# EAGLE design AZPR EvBoard (EAGLE 6.1)
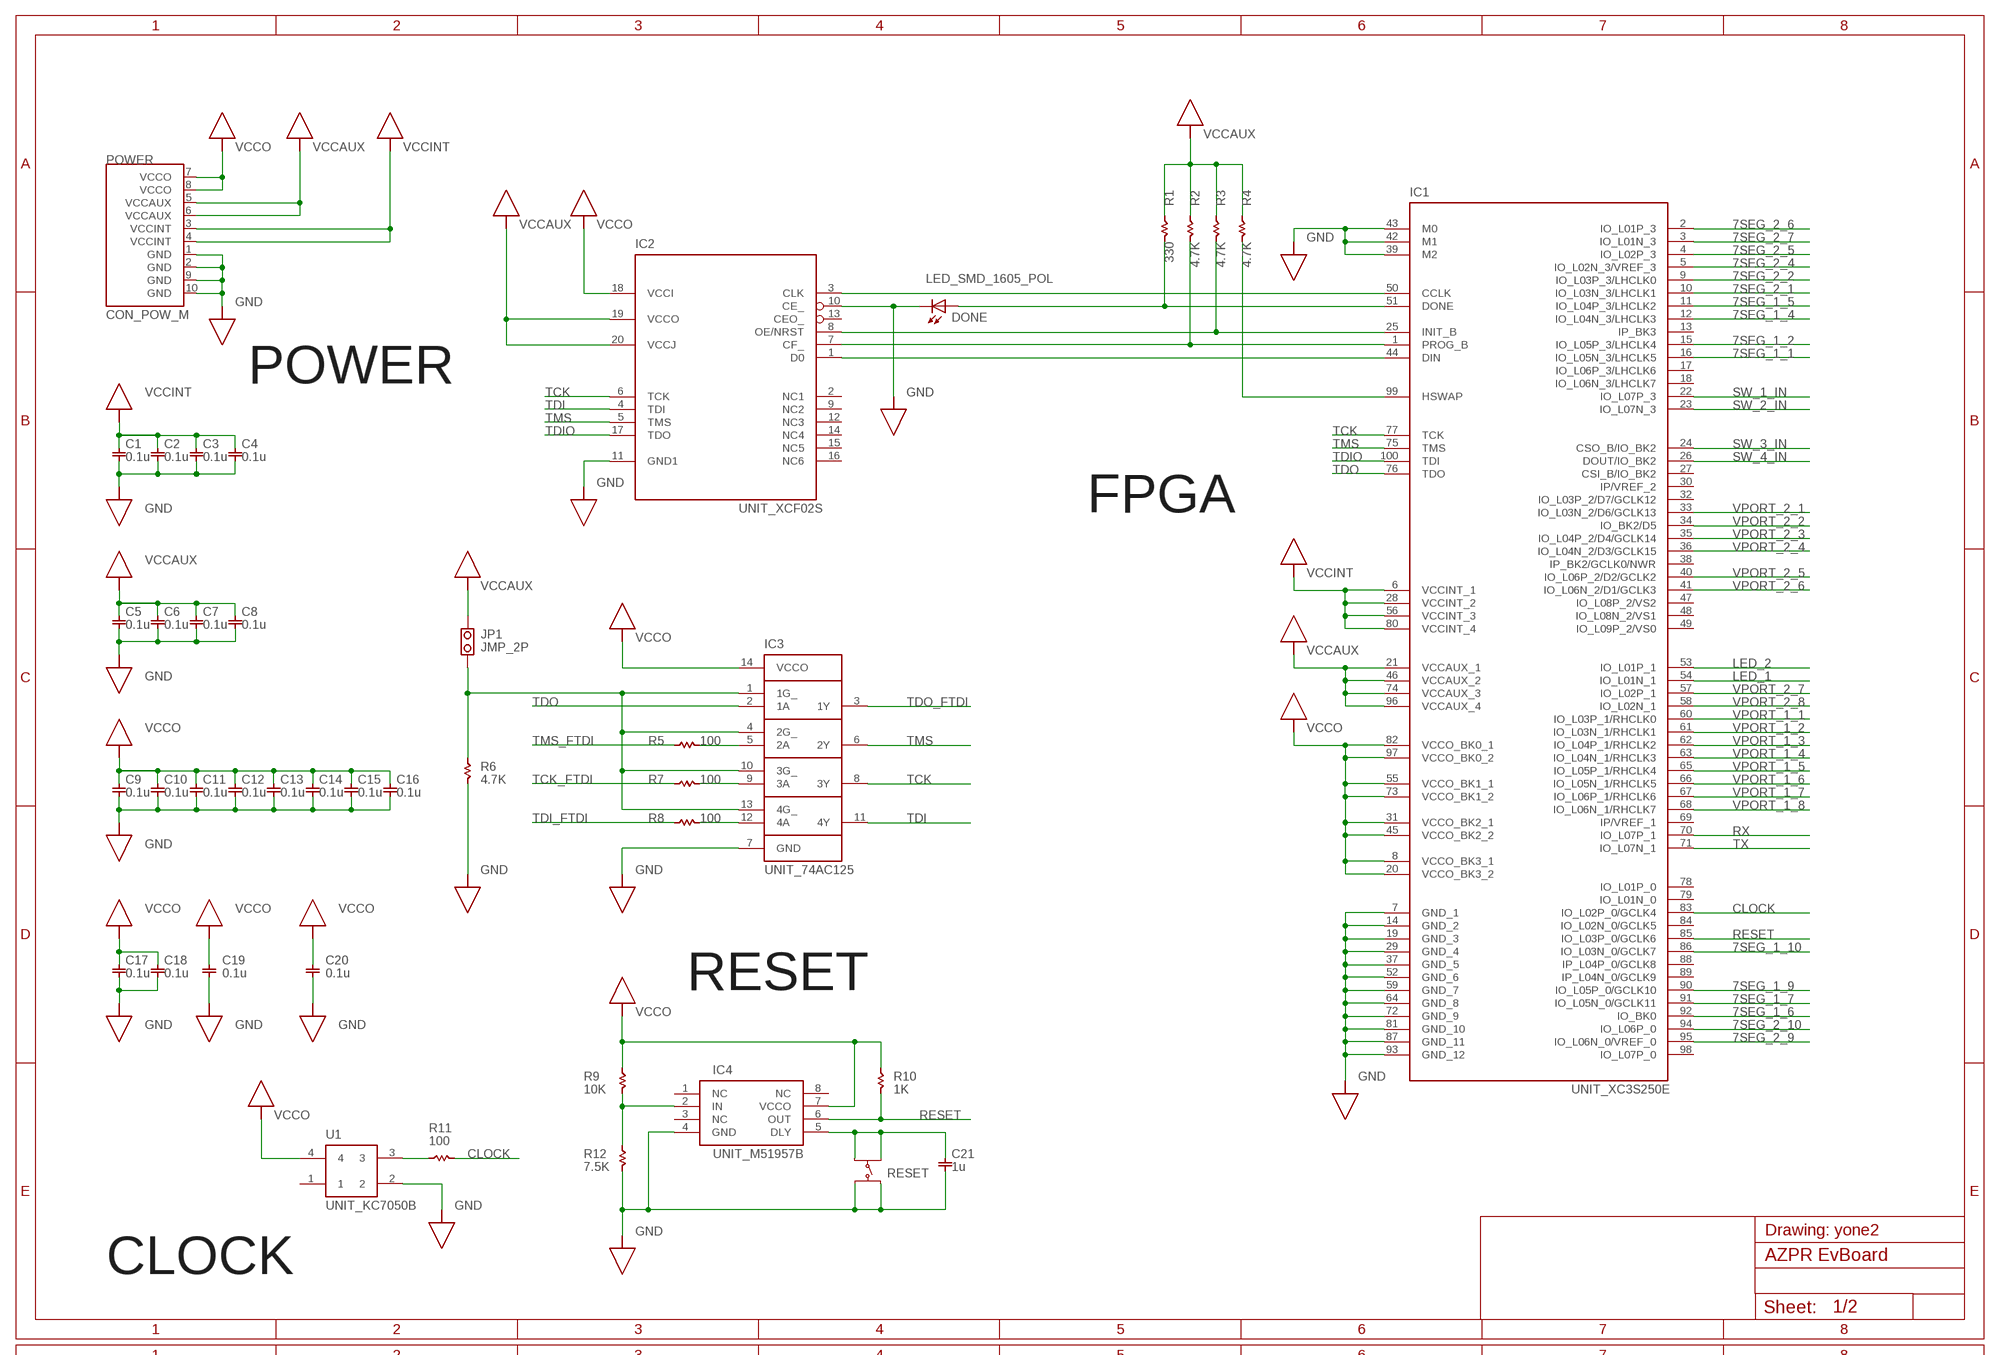
[diagram p0: schematic, sheet 1, part 1 of 2]
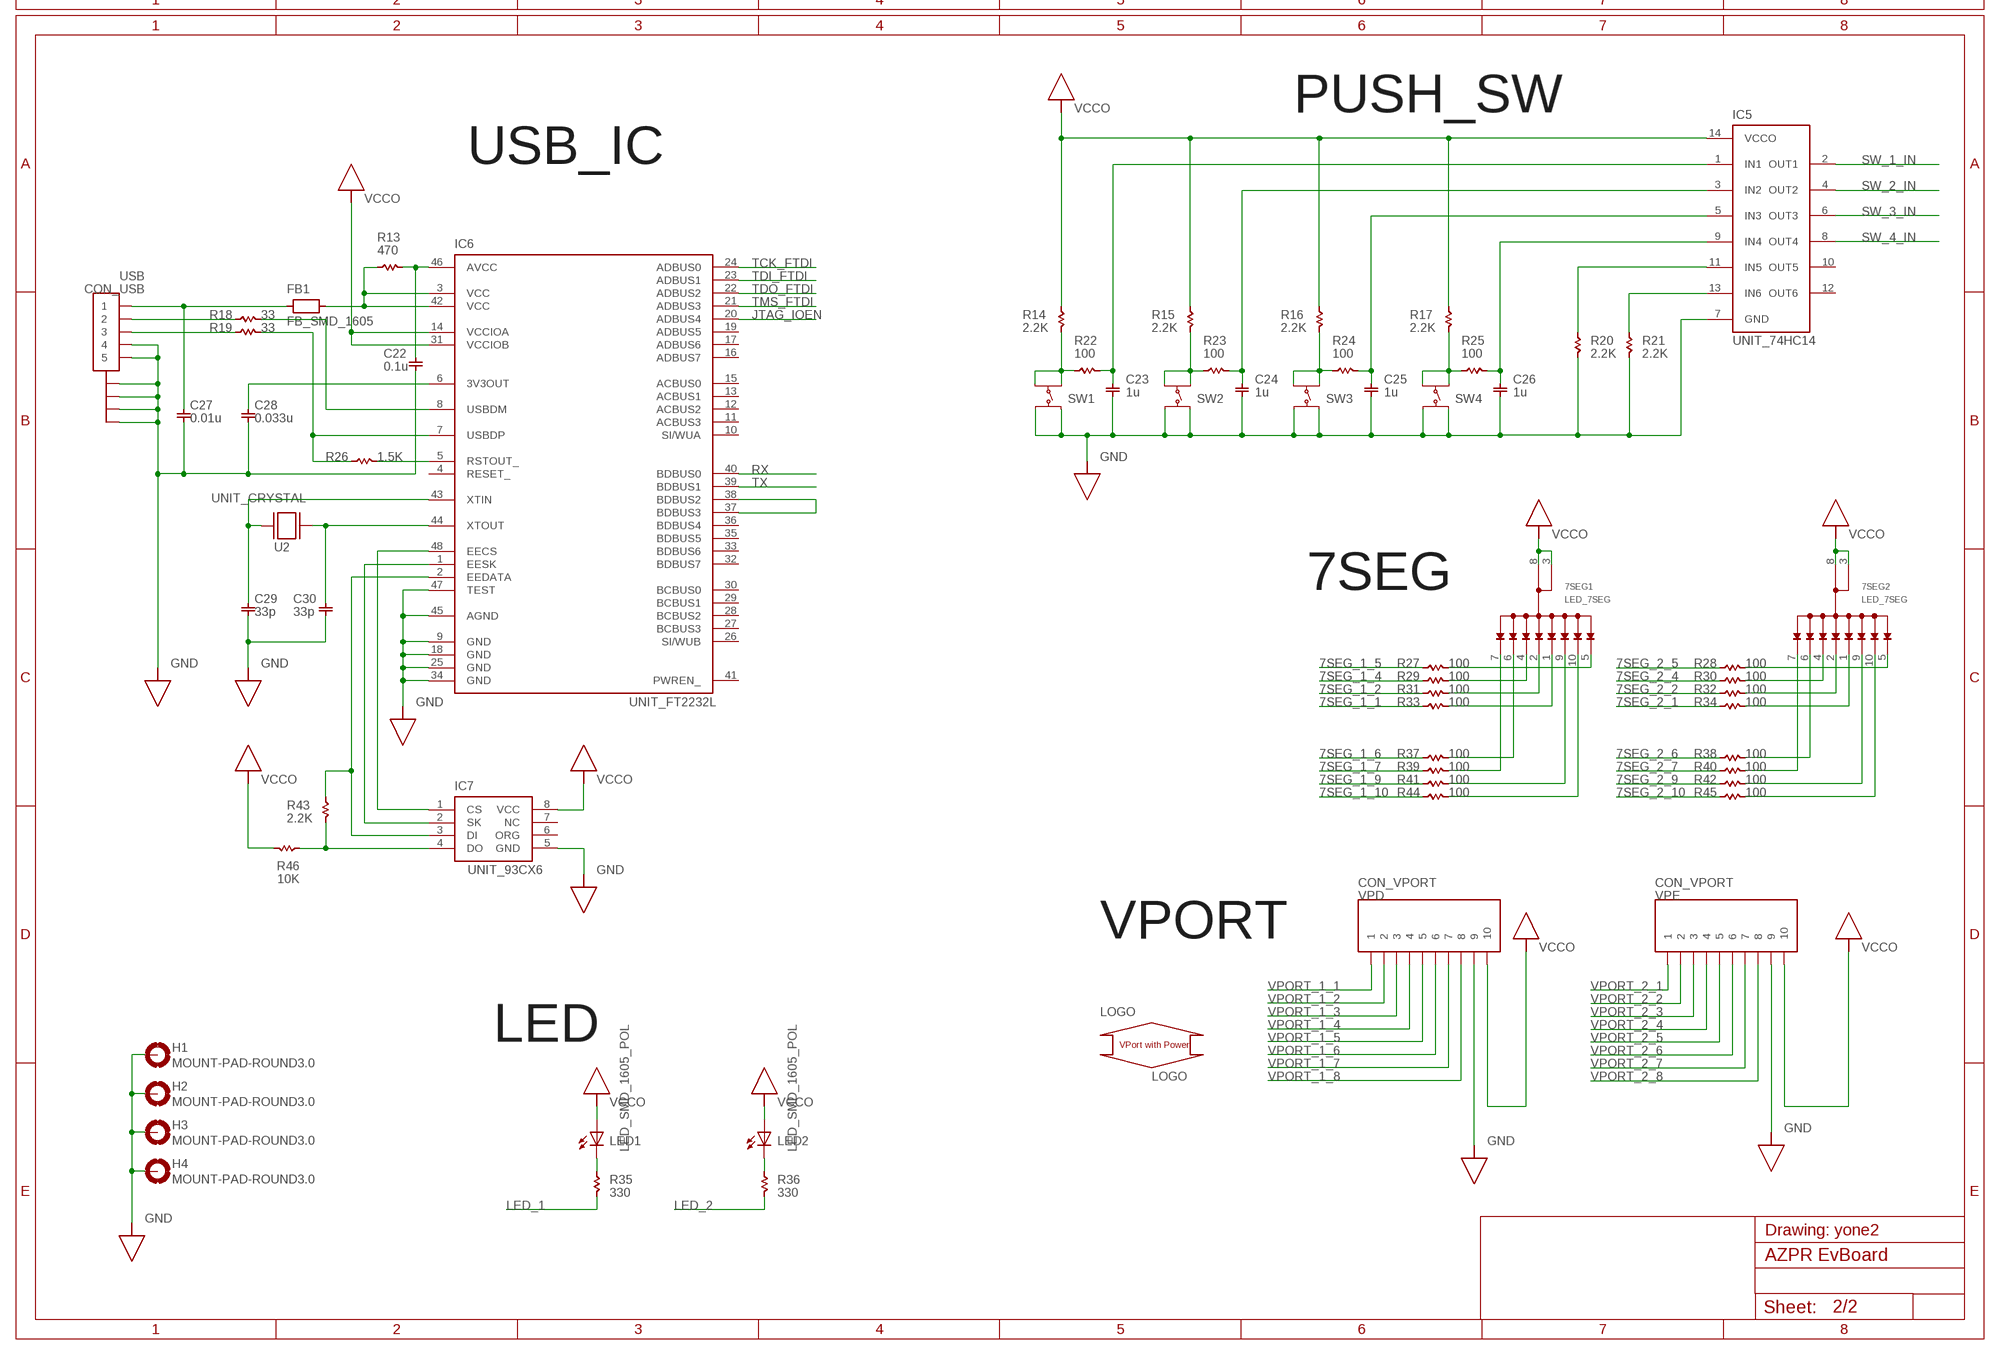
[diagram p1: schematic, sheet 1, part 2 of 2]

## Parts
7SEG1  LED_7SEG  [SMD_LED_7SEG]
7SEG2  LED_7SEG  [SMD_LED_7SEG]
C1  0.1u  CAP_SMDPAD_1605_04INCH  [SMDPAD_1605_04INCH]
C2  0.1u  CAP_SMDPAD_1605_04INCH  [SMDPAD_1605_04INCH]
C3  0.1u  CAP_SMDPAD_1605_04INCH  [SMDPAD_1605_04INCH]
C4  0.1u  CAP_SMDPAD_1605_04INCH  [SMDPAD_1605_04INCH]
C5  0.1u  CAP_SMDPAD_1605_03INCH  [SMDPAD_1605_03INCH]
C6  0.1u  CAP_SMDPAD_1605_03INCH  [SMDPAD_1605_03INCH]
C7  0.1u  CAP_SMDPAD_1605_03INCH  [SMDPAD_1605_03INCH]
C8  0.1u  CAP_SMDPAD_1605_03INCH  [SMDPAD_1605_03INCH]
C9  0.1u  CAP_SMDPAD_1605_02INCH  [SMDPAD_1605_02INCH]
C10  0.1u  CAP_SMDPAD_1605_02INCH  [SMDPAD_1605_02INCH]
C11  0.1u  CAP_SMDPAD_1605_02INCH  [SMDPAD_1605_02INCH]
C12  0.1u  CAP_SMDPAD_1605_02INCH  [SMDPAD_1605_02INCH]
C13  0.1u  CAP_SMDPAD_1605_02INCH  [SMDPAD_1605_02INCH]
C14  0.1u  CAP_SMDPAD_1605_02INCH  [SMDPAD_1605_02INCH]
C15  0.1u  CAP_SMDPAD_1605_02INCH  [SMDPAD_1605_02INCH]
C16  0.1u  CAP_SMDPAD_1605_02INCH  [SMDPAD_1605_02INCH]
C17  0.1u  CAP_SMDPAD_1605_02INCH  [SMDPAD_1605_02INCH]
C18  0.1u  CAP_SMD_1605  [SMD_1605]
C19  0.1u  CAP_SMD_1605  [SMD_1605]
C20  0.1u  CAP_SMD_1605  [SMD_1605]
C21  1u  CAP_SMD_1605  [SMD_1605]
C22  0.1u  CAP_SMD_1605  [SMD_1605]
C23  1u  CAP_SMD_1605  [SMD_1605]
C24  1u  CAP_SMD_1605  [SMD_1605]
C25  1u  CAP_SMD_1605  [SMD_1605]
C26  1u  CAP_SMD_1605  [SMD_1605]
C27  0.01u  CAP_SMD_1605  [SMD_1605]
C28  0.033u  CAP_SMD_1605  [SMD_1605]
C29  33p  CAP_SMD_1605  [SMD_1605]
C30  33p  CAP_SMD_1605  [SMD_1605]
DONE  LED_SMD_1605_POL  [SMD_1605_POL]
FB1  FB_SMD_1605  [SMD_1605]
H1  MOUNT-PAD-ROUND3.0  HOLE_32  [HOLE_32]
H2  MOUNT-PAD-ROUND3.0  HOLE_32  [HOLE_32]
H3  MOUNT-PAD-ROUND3.0  HOLE_32  [HOLE_32]
H4  MOUNT-PAD-ROUND3.0  HOLE_32  [HOLE_32]
IC1  UNIT_XC3S250E  [SMD_VQ100]
IC2  UNIT_XCF02S  [SMD_VO20C]
IC3  UNIT_74AC125  [SMD_SOP14]
IC4  UNIT_M51957B  [SMD_SOP8]
IC5  UNIT_74HC14  [SMD_SOP14]
IC6  UNIT_FT2232L  [SMD_LQFP48]
IC7  UNIT_93CX6  [SMD_SOP8]
JP1  JMP_2P  [PAD_JMP_2P]
LED1  LED_SMD_1605_POL  [SMD_1605_POL]
LED2  LED_SMD_1605_POL  [SMD_1605_POL]
LOGO  LOGO  [LOGO]
POWER  CON_POW_M  [PAD_POW_M]
R1  330  REG_SMD_1605  [SMD_1605_R]
R2  4.7K  REG_SMD_1605  [SMD_1605_R]
R3  4.7K  REG_SMD_1605  [SMD_1605_R]
R4  4.7K  REG_SMD_1605  [SMD_1605_R]
R5  100  REG_SMD_1605  [SMD_1605_R]
R6  4.7K  REG_SMD_1605  [SMD_1605_R]
R7  100  REG_SMD_1605  [SMD_1605_R]
R8  100  REG_SMD_1605  [SMD_1605_R]
R9  10K  REG_SMD_1605  [SMD_1605_R]
R10  1K  REG_SMD_1605  [SMD_1605_R]
R11  100  REG_SMD_1605  [SMD_1605_R]
R12  7.5K  REG_SMD_1605  [SMD_1605_R]
R13  470  REG_SMD_1605  [SMD_1605_R]
R14  2.2K  REG_SMD_1605  [SMD_1605_R]
R15  2.2K  REG_SMD_1605  [SMD_1605_R]
R16  2.2K  REG_SMD_1605  [SMD_1605_R]
R17  2.2K  REG_SMD_1605  [SMD_1605_R]
R18  33  REG_SMD_1605  [SMD_1605_R]
R19  33  REG_SMD_1605  [SMD_1605_R]
R20  2.2K  REG_SMD_1605  [SMD_1605_R]
R21  2.2K  REG_SMD_1605  [SMD_1605_R]
R22  100  REG_SMD_1605  [SMD_1605_R]
R23  100  REG_SMD_1605  [SMD_1605_R]
R24  100  REG_SMD_1605  [SMD_1605_R]
R25  100  REG_SMD_1605  [SMD_1605_R]
R26  1.5K  REG_SMD_1605  [SMD_1605_R]
R27  100  REG_SMD_1605  [SMD_1605_R]
R28  100  REG_SMD_1605  [SMD_1605_R]
R29  100  REG_SMD_1605  [SMD_1605_R]
R30  100  REG_SMD_1605  [SMD_1605_R]
R31  100  REG_SMD_1605  [SMD_1605_R]
R32  100  REG_SMD_1605  [SMD_1605_R]
R33  100  REG_SMD_1605  [SMD_1605_R]
R34  100  REG_SMD_1605  [SMD_1605_R]
R35  330  REG_SMD_1605  [SMD_1605_R]
R36  330  REG_SMD_1605  [SMD_1605_R]
R37  100  REG_SMD_1605  [SMD_1605_R]
R38  100  REG_SMD_1605  [SMD_1605_R]
R39  100  REG_SMD_1605  [SMD_1605_R]
R40  100  REG_SMD_1605  [SMD_1605_R]
R41  100  REG_SMD_1605  [SMD_1605_R]
R42  100  REG_SMD_1605  [SMD_1605_R]
R43  2.2K  REG_SMD_1605  [SMD_1605_R]
R44  100  REG_SMD_1605  [SMD_1605_R]
R45  100  REG_SMD_1605  [SMD_1605_R]
R46  10K  REG_SMD_1605  [SMD_1605_R]
RESET  SW_PUSH  [SMD_SW_PUSH]
SW1  SW_PUSH  [SMD_SW_PUSH]
SW2  SW_PUSH  [SMD_SW_PUSH]
SW3  SW_PUSH  [SMD_SW_PUSH]
SW4  SW_PUSH  [SMD_SW_PUSH]
U1  UNIT_KC7050B  [SMD_KC7050B]
U2  UNIT_CRYSTAL  [SMD_HC-49_S]
USB  CON_USB  [SMD_USB]
VPD  CON_VPORT  [PAD_VPORT]
VPE  CON_VPORT  [PAD_VPORT]

## Nets
7SEG_1_1: IC1.16(IO_L05N_3/LHCLK5) R33.1
7SEG_1_2: IC1.15(IO_L05P_3/LHCLK4) R31.1
7SEG_1_4: IC1.12(IO_L04N_3/LHCLK3) R29.1
7SEG_1_5: IC1.11(IO_L04P_3/LHCLK2) R27.1
7SEG_1_6: IC1.92(IO_BK0) R37.1
7SEG_1_7: IC1.91(IO_L05N_0/GCLK11) R39.1
7SEG_1_9: IC1.90(IO_L05P_0/GCLK10) R41.1
7SEG_1_10: IC1.86(IO_L03N_0/GCLK7) R44.1
7SEG_2_1: IC1.10(IO_L03N_3/LHCLK1) R34.1
7SEG_2_2: IC1.9(IO_L03P_3/LHCLK0) R32.1
7SEG_2_4: IC1.5(IO_L02N_3/VREF_3) R30.1
7SEG_2_5: IC1.4(IO_L02P_3) R28.1
7SEG_2_6: IC1.2(IO_L01P_3) R38.1
7SEG_2_7: IC1.3(IO_L01N_3) R40.1
7SEG_2_9: IC1.95(IO_L06N_0/VREF_0) R42.1
7SEG_2_10: IC1.94(IO_L06P_0) R45.1
CLOCK: IC1.83(IO_L02P_0/GCLK4) R11.2
EECS: IC6.48(EECS) IC7.1(CS)
EEDATA: IC6.2(EEDATA) IC7.3(DI) R43.1
EESK: IC6.1(EESK) IC7.2(SK)
EETMP: IC7.4(DO) R43.2 R46.1
GND: C1.P$2 C2.P$2 C3.P$2 C4.P$2 C5.P$2 C6.P$2 C7.P$2 C8.P$2 C9.P$2 C10.P$2 C11.P$2 C12.P$2 C13.P$2 C14.P$2 C15.P$2 C16.P$2 C17.P$2 C18.2 C19.2 C20.2 C21.2 C22.2 C23.2 C24.2 C25.2 C26.2 C27.2 C28.2 C29.2 C30.2 DONE.C H1.B3,2(MOUNT) H2.B3,2(MOUNT) H3.B3,2(MOUNT) H4.B3,2(MOUNT) IC1.7(GND_1) IC1.14(GND_2) IC1.19(GND_3) IC1.29(GND_4) IC1.37(GND_5) IC1.39(M2) IC1.42(M1) IC1.43(M0) IC1.52(GND_6) IC1.59(GND_7) IC1.64(GND_8) IC1.72(GND_9) IC1.81(GND_10) IC1.87(GND_11) IC1.93(GND_12) IC2.10(CE_) IC2.11(GND1) IC3.7(GND) IC4.4(GND) IC5.7(GND) IC6.9(GND) IC6.18(GND) IC6.25(GND) IC6.34(GND) IC6.45(AGND) IC6.47(TEST) IC7.5(GND) POWER.1(GND) POWER.2(GND) POWER.9(GND) POWER.10(GND) R6.2 R12.2 R20.2 R21.2 RESET.3 RESET.4 SW1.3 SW1.4 SW2.3 SW2.4 SW3.3 SW3.4 SW4.3 SW4.4 U1.2 USB.4 USB.5 USB.PAD@1(PAD1) USB.PAD@2(PAD2) USB.PAD@3(PAD3) USB.PAD@4(PAD4) VPD.9 VPE.9
JTAG_CCLK: IC1.50(CCLK) IC2.3(CLK)
JTAG_DIN: IC1.44(DIN) IC2.1(D0)
JTAG_DONE: DONE.A IC1.51(DONE) R1.2
JTAG_HSWAP: IC1.99(HSWAP) R4.2
JTAG_INIT_B: IC1.25(INIT_B) IC2.8(OE/NRST) R3.2
JTAG_IOEN: IC6.20(ADBUS4)
JTAG_PROG_B: IC1.1(PROG_B) IC2.7(CF_) R2.2
LED_1: IC1.54(IO_L01N_1) R35.2
LED_2: IC1.53(IO_L01P_1) R36.2
N$1: IC3.1(1G_) IC3.4(2G_) IC3.10(3G_) IC3.13(4G_) JP1.P$2 R6.1
N$2: LED1.C R35.1
N$3: IC3.5(2A) R5.2
N$5: IC3.9(3A) R7.2
N$6: IC3.12(4A) R8.2
N$11: LED2.C R36.1
N$18: IC6.37(BDBUS3) IC6.38(BDBUS2)
N$58: R11.1 U1.3
RESET: IC1.85(IO_L03P_0/GCLK6) IC4.6(OUT) R10.2
RESET_IN: IC4.2(IN) R9.2 R12.1
RESET_SW: C21.1 IC4.5(DLY) RESET.1 RESET.2
RX: IC1.70(IO_L07P_1) IC6.40(BDBUS0)
SW_1_IN: IC1.22(IO_L07P_3) IC5.2(OUT1)
SW_1_IN_T: C23.1 IC5.1(IN1) R22.2
SW_1_IN_T2: R14.2 R22.1 SW1.1 SW1.2
SW_2_IN: IC1.23(IO_L07N_3) IC5.4(OUT2)
SW_2_IN_T: C24.1 IC5.3(IN2) R23.2
SW_2_IN_T2: R15.2 R23.1 SW2.1 SW2.2
SW_3_IN: IC1.24(CSO_B/IO_BK2) IC5.6(OUT3)
SW_3_IN_T: C25.1 IC5.5(IN3) R24.2
SW_3_IN_T2: R16.2 R24.1 SW3.1 SW3.2
SW_4_IN: IC1.26(DOUT/IO_BK2) IC5.8(OUT4)
SW_4_IN_T: C26.1 IC5.9(IN4) R25.2
SW_4_IN_T2: R17.2 R25.1 SW4.1 SW4.2
SW_PD_1: IC5.11(IN5) R20.1
SW_PD_2: IC5.13(IN6) R21.1
T_7SEG_1_1: 7SEG1.1(E) R33.2
T_7SEG_1_2: 7SEG1.2(D) R31.2
T_7SEG_1_4: 7SEG1.4(C) R29.2
T_7SEG_1_5: 7SEG1.5(D.P) R27.2
T_7SEG_1_6: 7SEG1.6(B) R37.2
T_7SEG_1_7: 7SEG1.7(A) R39.2
T_7SEG_1_9: 7SEG1.9(F) R41.2
T_7SEG_1_10: 7SEG1.10(G) R44.2
T_7SEG_2_1: 7SEG2.1(E) R34.2
T_7SEG_2_2: 7SEG2.2(D) R32.2
T_7SEG_2_4: 7SEG2.4(C) R30.2
T_7SEG_2_5: 7SEG2.5(D.P) R28.2
T_7SEG_2_6: 7SEG2.6(B) R38.2
T_7SEG_2_7: 7SEG2.7(A) R40.2
T_7SEG_2_9: 7SEG2.9(F) R42.2
T_7SEG_2_10: 7SEG2.10(G) R45.2
TCK: IC1.77(TCK) IC2.6(TCK) IC3.8(3Y)
TCK_FTDI: IC6.24(ADBUS0) R7.1
TDI: IC2.4(TDI) IC3.11(4Y)
TDI_FTDI: IC6.23(ADBUS1) R8.1
TDIO: IC1.100(TDI) IC2.17(TDO)
TDO: IC1.76(TDO) IC3.2(1A)
TDO_FTDI: IC3.3(1Y) IC6.22(ADBUS2)
TMS: IC1.75(TMS) IC2.5(TMS) IC3.6(2Y)
TMS_FTDI: IC6.21(ADBUS3) R5.1
TX: IC1.71(IO_L07N_1) IC6.39(BDBUS1)
USB_33OUT: C28.1 IC6.6(3V3OUT)
USB_AVCC: C22.1 IC6.46(AVCC) R13.2
USB_CON1: C27.1 FB1.1 USB.1
USB_CON2: R18.1 USB.2
USB_CON3: R19.1 USB.3
USB_DM: IC6.8(USBDM) R18.2
USB_DP: IC6.7(USBDP) R19.2 R26.1
USB_POW: FB1.2 IC6.3(VCC) IC6.42(VCC) R13.1
USB_RSTOUT_: IC6.5(RSTOUT_) R26.2
VCCAUX: C5.P$1 C6.P$1 C7.P$1 C8.P$1 IC1.21(VCCAUX_1) IC1.46(VCCAUX_2) IC1.74(VCCAUX_3) IC1.96(VCCAUX_4) IC2.19(VCCO) IC2.20(VCCJ) JP1.P$1 POWER.5(VCCAUX) POWER.6(VCCAUX) R1.1 R2.1 R3.1 R4.1
VCCINT: C1.P$1 C2.P$1 C3.P$1 C4.P$1 IC1.6(VCCINT_1) IC1.28(VCCINT_2) IC1.56(VCCINT_3) IC1.80(VCCINT_4) POWER.3(VCCINT) POWER.4(VCCINT)
VCCO: 7SEG1.3(COMMON3) 7SEG1.8(COMMON8) 7SEG2.3(COMMON3) 7SEG2.8(COMMON8) C9.P$1 C10.P$1 C11.P$1 C12.P$1 C13.P$1 C14.P$1 C15.P$1 C16.P$1 C17.P$1 C18.1 C19.1 C20.1 IC1.8(VCCO_BK3_1) IC1.20(VCCO_BK3_2) IC1.31(VCCO_BK2_1) IC1.45(VCCO_BK2_2) IC1.55(VCCO_BK1_1) IC1.73(VCCO_BK1_2) IC1.82(VCCO_BK0_1) IC1.97(VCCO_BK0_2) IC2.18(VCCI) IC3.14(VCCO) IC4.7(VCCO) IC5.14(VCCO) IC6.14(VCCIOA) IC6.31(VCCIOB) IC7.8(VCC) LED1.A LED2.A POWER.7(VCCO) POWER.8(VCCO) R9.1 R10.1 R14.1 R15.1 R16.1 R17.1 R46.2 U1.4 VPD.10 VPE.10
VPORT_1_1: IC1.60(IO_L03P_1/RHCLK0) VPD.1
VPORT_1_2: IC1.61(IO_L03N_1/RHCLK1) VPD.2
VPORT_1_3: IC1.62(IO_L04P_1/RHCLK2) VPD.3
VPORT_1_4: IC1.63(IO_L04N_1/RHCLK3) VPD.4
VPORT_1_5: IC1.65(IO_L05P_1/RHCLK4) VPD.5
VPORT_1_6: IC1.66(IO_L05N_1/RHCLK5) VPD.6
VPORT_1_7: IC1.67(IO_L06P_1/RHCLK6) VPD.7
VPORT_1_8: IC1.68(IO_L06N_1/RHCLK7) VPD.8
VPORT_2_1: IC1.33(IO_L03N_2/D6/GCLK13) VPE.1
VPORT_2_2: IC1.34(IO_BK2/D5) VPE.2
VPORT_2_3: IC1.35(IO_L04P_2/D4/GCLK14) VPE.3
VPORT_2_4: IC1.36(IO_L04N_2/D3/GCLK15) VPE.4
VPORT_2_5: IC1.40(IO_L06P_2/D2/GCLK2) VPE.5
VPORT_2_6: IC1.41(IO_L06N_2/D1/GCLK3) VPE.6
VPORT_2_7: IC1.57(IO_L02P_1) VPE.7
VPORT_2_8: IC1.58(IO_L02N_1) VPE.8
XTIN: C29.1 IC6.43(XTIN) U2.P$1
XTOUT: C30.1 IC6.44(XTOUT) U2.P$2
Unconnected: IC1.13(IP_BK3) IC1.17(IO_L06P_3/LHCLK6) IC1.18(IO_L06N_3/LHCLK7) IC1.27(CSI_B/IO_BK2) IC1.30(IP/VREF_2) IC1.32(IO_L03P_2/D7/GCLK12) IC1.38(IP_BK2/GCLK0/NWR) IC1.47(IO_L08P_2/VS2) IC1.48(IO_L08N_2/VS1) IC1.49(IO_L09P_2/VS0) IC1.69(IP/VREF_1) IC1.78(IO_L01P_0) IC1.79(IO_L01N_0) IC1.84(IO_L02N_0/GCLK5) IC1.88(IP_L04P_0/GCLK8) IC1.89(IP_L04N_0/GCLK9) IC1.98(IO_L07P_0) IC2.2(NC1) IC2.9(NC2) IC2.12(NC3) IC2.13(CEO_) IC2.14(NC4) IC2.15(NC5) IC2.16(NC6) IC4.1(NC) IC4.3(NC) IC4.8(NC) IC5.10(OUT5) IC5.12(OUT6) IC6.4(RESET_) IC6.10(SI/WUA) IC6.11(ACBUS3) IC6.12(ACBUS2) IC6.13(ACBUS1) IC6.15(ACBUS0) IC6.16(ADBUS7) IC6.17(ADBUS6) IC6.19(ADBUS5) IC6.26(SI/WUB) IC6.27(BCBUS3) IC6.28(BCBUS2) IC6.29(BCBUS1) IC6.30(BCBUS0) IC6.32(BDBUS7) IC6.33(BDBUS6) IC6.35(BDBUS5) IC6.36(BDBUS4) IC6.41(PWREN_) IC7.6(ORG) IC7.7(NC) U1.1

## Notes on the sheet
- POWER
- FPGA
- RESET
- CLOCK
- PUSH_SW
- USB_IC
- 7SEG
- VPORT
- LED

## Library data of the parts
7SEG1 7SEG2 = 00_Respon:LED_7SEG: 7seg led LF-301VA - anode common - SMD
C1-C4 = 00_Respon:CAP_SMDPAD_1605_04INCH: ceramic capacitor - SMD or PAD package - 1605 or 2125 - 0.4-inch interval
C5-C8 = 00_Respon:CAP_SMDPAD_1605_03INCH: ceramic capacitor - SMD or PAD package - 1605 or 2125 - 0.3-inch interval
C9-C17 = 00_Respon:CAP_SMDPAD_1605_02INCH: ceramic capacitor - SMD or PAD package - 1605 or 2125 - 0.2-inch interval
C18-C30 = 00_Respon:CAP_SMD_1605: resistor SMD package 1605 or 2125 size
DONE LED1 LED2 = 00_Respon:LED_SMD_1605_POL: LED - SMD package - 0.1inch interval
FB1 = 00_Respon:FB_SMD_1605: ferrite beads SMD package 1605 or 2125 size
H1-H4 = 00_Respon:HOLE_32: Mounting PAD 3.2mm
IC1 = 00_Respon:UNIT_XC3S250E: XC3S250E-VQ100 Xilinx Spartan-3E FPGA device
IC2 = 00_Respon:UNIT_XCF02S: XCF02S Xilinx FPGA Configration ROM XCF02S VO20C
IC3 = 00_Respon:UNIT_74AC125
IC4 = 00_Respon:UNIT_M51957B: M51957B
IC5 = 00_Respon:UNIT_74HC14: 74VHC14
IC6 = 00_Respon:UNIT_FT2232L
IC7 = 00_Respon:UNIT_93CX6
JP1 = 00_Respon:JMP_2P
LOGO = 00_Respon:LOGO: VPort logo
POWER = 00_Respon:CON_POW_M: pin header - 2*5 - L angle
R1-R46 = 00_Respon:REG_SMD_1605: resistor SMD package 1605 or 2125
RESET SW1-SW4 = 00_Respon:SW_PUSH; PUSH-SW: PUSH-WS
U1 = 00_Respon:UNIT_KC7050B: KC7050B Clock Crystal Oscillators SMD pakage
U2 = 00_Respon:UNIT_CRYSTAL: Crystal Units SMD package
USB = 00_Respon:CON_USB: UX60A-MB-5ST USB mini-B connector HRS
VPD VPE = 00_Respon:CON_VPORT: BOX header - 2*5

## Board
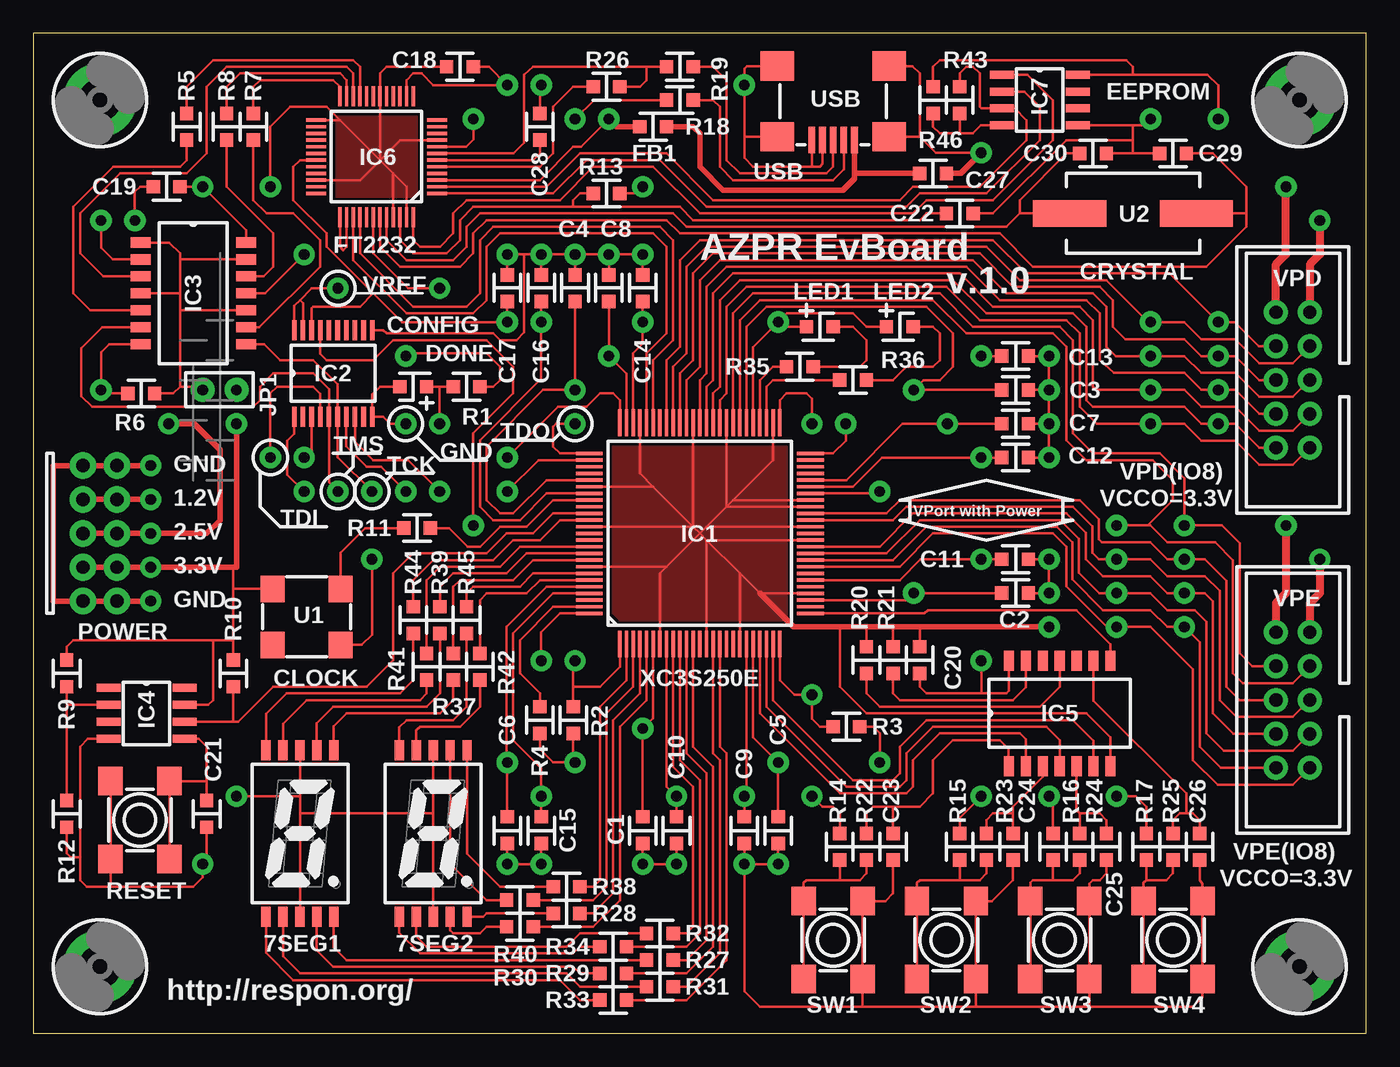
[diagram p2: board, top side]
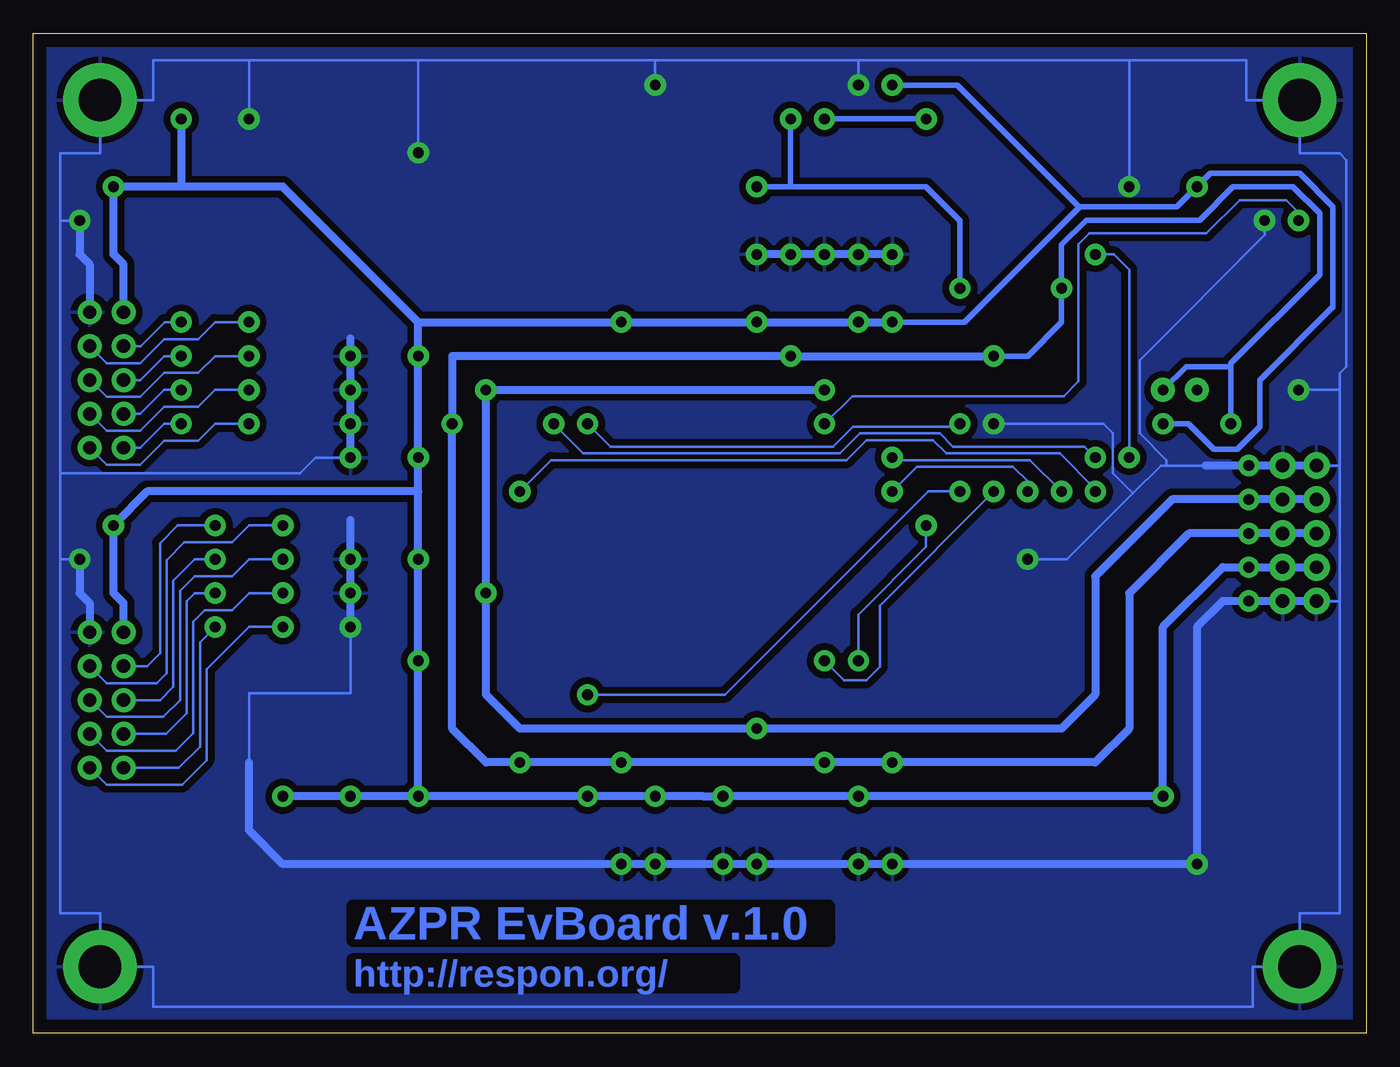
[diagram p3: board, bottom side, seen from below]

Size 100 x 75 mm. Coordinates in mm from the lower left corner, seen from the top.
Outline: 0,0 100,0 100,75 0,75 0,0
Copper layers (1*16): Top 0.035mm / dielectric 1.53mm / Bottom 0.035mm
Design rules: minimum track width 8mil, minimum drill 0.6mm, track to track 8mil, track to pad 8mil, pad to pad 8mil, via to via 8mil, smd to smd 8mil, copper to edge 40mil, drill to drill 10mil, minimum pad ring 0.15mm, minimum via ring 0.15mm, stop-mask expansion 6mil, vias tented up to drill 0.35mm, thermal gap 20mil

### Footprints (pad centres in the part's own frame; a part is rotated, then mirrored left to right if it is on the bottom)
SMD_LED_7SEG = smd 0.7 x 1.5: 1 -2.54,-6.25; 2 -1.27,-6.25; 3 0,-6.25; 4 1.27,-6.25; 5 2.54,-6.25; 6 2.54,6.25; 7 1.27,6.25; 8 0,6.25; 9 -1.27,6.25; 10 -2.54,6.25
SMDPAD_1605_04INCH = smd 1 x 1: 1 -1.54,0; 2 -3.54,0 | drill 0.8 pad 1.6: P$1 -10.16,0; P$2 0,0
SMDPAD_1605_03INCH = smd 1 x 1: 1 -1.54,0; 2 -3.54,0 | drill 0.8 pad 1.6: P$1 -7.62,0; P$2 0,0
SMDPAD_1605_02INCH = smd 1 x 1: 1 -1.54,0; 2 -3.54,0 | drill 0.8 pad 1.6: P$1 -5.08,0; P$2 0,0
SMD_1605 = smd 1 x 1: 1 1,0; 2 -1,0
SMD_1605_POL = smd 1 x 1: A -1,0; C 1,0
HOLE_32 = drill 3.2 pad 5.5: B3,2 0,0
SMD_VQ100 = smd 2 x 0.25: 1 -8.3,6; 2 -8.3,5.5; 3 -8.3,5; 4 -8.3,4.5; 5 -8.3,4; 6 -8.3,3.5; 7 -8.3,3; 8 -8.3,2.5; 9 -8.3,2; 10 -8.3,1.5; 11 -8.3,1; 12 -8.3,0.5; 13 -8.3,0; 14 -8.3,-0.5; 15 -8.3,-1; 16 -8.3,-1.5; 17 -8.3,-2; 18 -8.3,-2.5; 19 -8.3,-3; 20 -8.3,-3.5; 21 -8.3,-4; 22 -8.3,-4.5; 23 -8.3,-5; 24 -8.3,-5.5; 25 -8.3,-6; 51 8.3,-6; 52 8.3,-5.5; 53 8.3,-5; 54 8.3,-4.5; 55 8.3,-4; 56 8.3,-3.5; 57 8.3,-3; 58 8.3,-2.5; 59 8.3,-2; 60 8.3,-1.5; 61 8.3,-1; 62 8.3,-0.5; 63 8.3,0; 64 8.3,0.5; 65 8.3,1; 66 8.3,1.5; 67 8.3,2; 68 8.3,2.5; 69 8.3,3; 70 8.3,3.5; 71 8.3,4; 72 8.3,4.5; 73 8.3,5; 74 8.3,5.5; 75 8.3,6 | smd 0.25 x 2: 26 -6,-8.3; 27 -5.5,-8.3; 28 -5,-8.3; 29 -4.5,-8.3; 30 -4,-8.3; 31 -3.5,-8.3; 32 -3,-8.3; 33 -2.5,-8.3; 34 -2,-8.3; 35 -1.5,-8.3; 36 -1,-8.3; 37 -0.5,-8.3; 38 0,-8.3; 39 0.5,-8.3; 40 1,-8.3; 41 1.5,-8.3; 42 2,-8.3; 43 2.5,-8.3; 44 3,-8.3; 45 3.5,-8.3; 46 4,-8.3; 47 4.5,-8.3; 48 5,-8.3; 49 5.5,-8.3; 50 6,-8.3; 76 6,8.3; 77 5.5,8.3; 78 5,8.3; 79 4.5,8.3; 80 4,8.3; 81 3.5,8.3; 82 3,8.3; 83 2.5,8.3; 84 2,8.3; 85 1.5,8.3; 86 1,8.3; 87 0.5,8.3; 88 0,8.3; 89 -0.5,8.3; 90 -1,8.3; 91 -1.5,8.3; 92 -2,8.3; 93 -2.5,8.3; 94 -3,8.3; 95 -3.5,8.3; 96 -4,8.3; 97 -4.5,8.3; 98 -5,8.3; 99 -5.5,8.3; 100 -6,8.3
SMD_VO20C = smd 1.5 x 0.35: 1 -3.25,2.925; 2 -3.25,2.275; 3 -3.25,1.625; 4 -3.25,0.975; 5 -3.25,0.325; 6 -3.25,-0.325; 7 -3.25,-0.975; 8 -3.25,-1.625; 9 -3.25,-2.275; 10 -3.25,-2.925; 11 3.25,-2.925; 12 3.25,-2.275; 13 3.25,-1.625; 14 3.25,-0.975; 15 3.25,-0.325; 16 3.25,0.325; 17 3.25,0.975; 18 3.25,1.625; 19 3.25,2.275; 20 3.25,2.925
SMD_SOP14 = smd 1.5 x 0.76: 1 -3.95,3.81; 2 -3.95,2.54; 3 -3.95,1.27; 4 -3.95,0; 5 -3.95,-1.27; 6 -3.95,-2.54; 7 -3.95,-3.81; 8 3.95,-3.81; 9 3.95,-2.54; 10 3.95,-1.27; 11 3.95,0; 12 3.95,1.27; 13 3.95,2.54; 14 3.95,3.81
SMD_SOP8 = smd 1.8 x 0.6: 1 -2.85,1.905; 2 -2.85,0.635; 3 -2.85,-0.635; 4 -2.85,-1.905; 5 2.85,-1.905; 6 2.85,-0.635; 7 2.85,0.635; 8 2.85,1.905
SMD_LQFP48 = smd 1.5 x 0.25: 1 -4.55,2.75; 2 -4.55,2.25; 3 -4.55,1.75; 4 -4.55,1.25; 5 -4.55,0.75; 6 -4.55,0.25; 7 -4.55,-0.25; 8 -4.55,-0.75; 9 -4.55,-1.25; 10 -4.55,-1.75; 11 -4.55,-2.25; 12 -4.55,-2.75; 25 4.55,-2.75; 26 4.55,-2.25; 27 4.55,-1.75; 28 4.55,-1.25; 29 4.55,-0.75; 30 4.55,-0.25; 31 4.55,0.25; 32 4.55,0.75; 33 4.55,1.25; 34 4.55,1.75; 35 4.55,2.25; 36 4.55,2.75 | smd 0.25 x 1.5: 13 -2.75,-4.55; 14 -2.25,-4.55; 15 -1.75,-4.55; 16 -1.25,-4.55; 17 -0.75,-4.55; 18 -0.25,-4.55; 19 0.25,-4.55; 20 0.75,-4.55; 21 1.25,-4.55; 22 1.75,-4.55; 23 2.25,-4.55; 24 2.75,-4.55; 37 2.75,4.55; 38 2.25,4.55; 39 1.75,4.55; 40 1.25,4.55; 41 0.75,4.55; 42 0.25,4.55; 43 -0.25,4.55; 44 -0.75,4.55; 45 -1.25,4.55; 46 -1.75,4.55; 47 -2.25,4.55; 48 -2.75,4.55
PAD_JMP_2P = drill 0.8 pad 1.8: P$1 0,-2.54; P$2 0,0
PAD_POW_M = drill 1 pad 2: 1 -1.27,5.08; 2 1.27,5.08; 3 -1.27,2.54; 4 1.27,2.54; 5 -1.27,0; 6 1.27,0; 7 -1.27,-2.54; 8 1.27,-2.54; 9 -1.27,-5.08; 10 1.27,-5.08
SMD_1605_R = smd 1 x 1: 1 1,0; 2 -1,0
SMD_SW_PUSH = smd 1.825 x 2.15: 1 -2.212,2.925; 2 -2.212,-2.925; 3 2.212,2.925; 4 2.212,-2.925
SMD_KC7050B = smd 1.8 x 2: 1 -2.54,-2.1; 2 2.54,-2.1; 3 2.54,2.1; 4 -2.54,2.1
SMD_HC-49_S = smd 5.5 x 2: P$1 4.75,0; P$2 -4.75,0
SMD_USB = smd 0.5 x 2: 1 -1.6,1; 2 -0.8,1; 3 0,1; 4 0.8,1; 5 1.6,1 | smd 2.5 x 2.2: PAD@1 -4.2,0.75; PAD@2 -4.2,-4.55; PAD@3 4.2,0.75; PAD@4 4.2,-4.55
PAD_VPORT = drill 1 pad 1.8: 1 -5.08,-1.27; 2 -5.08,1.27; 3 -2.54,-1.27; 4 -2.54,1.27; 5 0,-1.27; 6 0,1.27; 7 2.54,-1.27; 8 2.54,1.27; 9 5.08,-1.27; 10 5.08,1.27

### Placement (x,y rotation side)
7SEG1  20,15 0 top
7SEG2  30,15 0 top
C1  45.72,12.7 270 top
C2  76.2,33.02 0 top
C3  76.2,48.26 0 top
C4  40.64,58.42 90 top
C5  55.88,12.7 270 top
C6  35.56,12.7 270 top
C7  76.2,45.72 0 top
C8  43.18,58.42 90 top
C9  53.34,12.7 270 top
C10  48.26,12.7 270 top
C11  76.2,35.56 0 top
C12  76.2,43.18 0 top
C13  76.2,50.8 0 top
C14  45.72,58.42 90 top
C15  38.1,12.7 270 top
C16  38.1,58.42 90 top
C17  35.56,58.42 90 top
C18  32,72.5 0 top
C19  10,63.5 0 top
C20  66.5,28 270 top
C21  13,16.46 90 top
C22  69.5,61.5 180 top
C23  64.5,14 90 top
C24  73.5,14 90 top
C25  80.5,14 90 top
C26  87.5,14 90 top
C27  67.5,64.5 180 top
C28  38,68 270 top
C29  85.5,66 0 top
C30  79.5,66 180 top
DONE  28.5,48.5 180 top
FB1  46.5,68 0 top
H1  5,5 0 top
H2  95,5 0 top
H3  95,70 0 top
H4  5,70 0 top
IC1  50,37.5 90 top
IC2  22.5,49.5 90 top
IC3  12,55.5 0 top
IC4  8.5,24 0 top
IC5  77,24 90 top
IC6  25.75,65.75 180 top
IC7  75.5,70 0 top
JP1  12.7,48.26 90 top
LED1  59,53 0 top
LED2  65,53 0 top
LOGO  71.5,41.5 0 top
POWER  5,37.5 0 top
R1  32.5,48.5 0 top
R2  40.5,23.5 270 top
R3  61,23 0 top
R4  38,23.5 270 top
R5  11.5,68 90 top
R6  8.1,48 0 top
R7  16.5,68 90 top
R8  14.5,68 90 top
R9  2.5,27 90 top
R10  15,27 90 top
R11  28.79,37.9 180 top
R12  2.5,16.46 90 top
R13  43,63 0 top
R14  60.5,14 90 top
R15  69.5,14 90 top
R16  76.5,14 90 top
R17  83.5,14 90 top
R18  48.5,70 0 top
R19  48.5,72.5 0 top
R20  62.5,28 270 top
R21  64.5,28 270 top
R22  62.5,14 270 top
R23  71.5,14 270 top
R24  78.5,14 270 top
R25  85.5,14 270 top
R26  43,71 0 top
R27  47,5.5 0 top
R28  40,9 0 top
R29  43.5,4.5 0 top
R30  36.5,8 0 top
R31  47,3.5 0 top
R32  47,7.5 0 top
R33  43.5,2.5 0 top
R34  43.5,6.5 0 top
R35  57.5,50 0 top
R36  61.5,49 0 top
R37  31.5,27.5 90 top
R38  40,11 0 top
R39  30.5,31 90 top
R40  36.5,10 0 top
R41  29.5,27.5 90 top
R42  33.5,27.5 90 top
R43  69.5,70 90 top
R44  28.5,31 90 top
R45  32.5,31 90 top
R46  67.5,70 270 top
RESET  8,16 180 top
SW1  60,7 0 top
SW2  68.5,7 0 top
SW3  77,7 0 top
SW4  85.5,7 0 top
U1  20.5,31.23 0 top
U2  82.5,61.5 0 top
USB  60,68 180 top
VPD  94.5,49 90 top
VPE  94.5,25 90 top

### Tracks (layer width: path | path; a pad name or v marks a point on that pad's centre or on a via)
7SEG_1_1
  Top 0.203: IC1.16 51.5,21.5 52,21 52,5.5 49,2.5 R33.1
7SEG_1_2
  Top 0.203: IC1.15 51,21 51.5,20.5 51.5,6 49,3.5 R31.1
7SEG_1_4
  Top 0.203: IC1.12 49.5,21.5 51,20 51,6.5 49,4.5 R29.1
7SEG_1_5
  Top 0.203: IC1.11 49,21 50.5,19.5 50.5,7 49,5.5 R27.1
7SEG_1_6
  Top 0.203: IC1.92 37.5,35.5 36,34 32,34 31.5,33.5 R37.1
7SEG_1_7
  Top 0.203: IC1.91 37,36 35.5,34.5 31.5,34.5 30.5,33.5 R39.1
7SEG_1_9
  Top 0.203: IC1.90 36.5,36.5 35,35 30.5,35 29.5,34 R41.1
7SEG_1_10
  Top 0.203: IC1.86 39.5,38.5 38,37 36,37 34.5,35.5 30,35.5 28.5,34 R44.1
7SEG_2_1
  Top 0.203: IC1.10 48.5,20.5 50,19 50,7.5 49,6.5 R34.1
7SEG_2_2
  Top 0.203: IC1.9 48,20 49.5,18.5 49.5,8 49,7.5 R32.1
7SEG_2_4
  Top 0.203: IC1.5 46,25 44,23 44,10 42,8 R30.1
7SEG_2_5
  Top 0.203: IC1.4 45.5,25.5 43.5,23.5 43.5,10.5 42,9 R28.1
7SEG_2_6
  Top 0.203: IC1.2 44.5,26.5 42.5,24.5 42.5,11.5 42,11 R38.1
7SEG_2_7
  Top 0.203: IC1.3 45,26 43,24 43,11 42,10 R40.1
7SEG_2_9
  Top 0.203: IC1.95 38,34 37,33 34,33 33.5,32.5 R42.1
7SEG_2_10
  Top 0.203: IC1.94 37.5,34.5 36.5,33.5 33,33.5 32.5,33 R45.1
CLOCK
  Top 0.203: IC1.83 39,40 37,38 35,38 33.5,36.5 32.58,36.5 31.18,37.9 R11.2
EECS
  Top 0.203: IC6.48 28.5,59.5 29,59 30.5,59 31.5,60 31.5,61.5 32.5,62.5 39.5,62.5 42,65 46.5,65 50,61.5 66,61.5 67,62.5 72,62.5 76.5,67 76.5,70 74.59,71.91 IC7.1
EEDATA
  Top 0.203: IC6.2 38.5,63.5 41,66 47.5,66 51,62.5 65,62.5 66,63.5 71,63.5 74.5,67 74.5,68.5 73.64,69.36 IC7.3 71.14,69.36 71,69.5 71,72 70.5,72.5 70,72.5 69.5,72 R43.1
EESK
  Top 0.203: IC6.1 39,63 41.5,65.5 47,65.5 50.5,62 65.5,62 66.5,63 71.5,63 75.5,67 75.5,69.5 74.36,70.64 IC7.2
EETMP
  Top 0.203: IC7.4 71.09,68.09 70.5,67.5 69.5,67.5 | 69.5,67.5 68,67.5 67.5,68 R46.1 | 69.5,67.5 R43.2
GND  (via drill 0.8 pad 1.6)
  Top 0.203: 49.5,38 IC1.87 | IC1.7 47,34.5 47.5,35 | 53,34.5 IC1.19 | 53,34.5 50.5,37 | 50.5,37 IC1.14 | 46.5,41 IC1.81 | 49.5,38 46.5,41 | IC1.72 45.5,42 46.5,41 | 52,39.5 IC1.59 | 49.5,38 IC1.64 | 50,37.5 49.5,38 | IC1.52 55.5,43 52.5,40 | 52.5,40 IC1.43 | 52,39.5 52.5,40 | IC1.29 54.5,33 53,34.5 | 50.5,37 IC1.37 | 50.5,37 50,37.5 | 50.5,38 IC1.39 | 50,37.5 50.5,38 | 52,39.5 IC1.42 | 50.5,38 52,39.5 | 47.5,35 IC1.93 | 50,37.5 47.5,35 | 64.5,30.48 R21.2 | 62.5,30.48 R20.2 | 66.5,30.48 C20.2 | 60.5,30.48 60.5,26 62.5,24 79,24 80.81,22.19 IC5.7 | 81.24,66 C30.2 82.5,66 | 82.5,66 C29.2 | IC6.34 24.5,64 26,65.5 | 27,64.5 IC6.45 | 26,65.5 27,64.5 | IC6.47 28,63.5 27,64.5 | IC6.9 27.5,67 26,65.5 | 26,65.5 IC6.18 26,72 26.5,72.5 C18.2 | 23,68.5 IC6.25 | 23,68.5 26,65.5 | 23,68.5 22,69.5 19.28,69.5 17.78,68 v17.78,63.5 | 36.83,58.42 36.83,52.57 36.26,52 35,52 34.5,52.5 26.5,52.5 26.25,52.75 IC2.11 | 36.83,58.42 C17.P$2 | 36.83,58.42 C16.P$2 C4.P$2 C8.P$2 C14.P$2 | C13.P$2 C3.P$2 C7.P$2 C12.P$2 | C2.P$2 C11.P$2 | C6.P$2 C15.P$2 | C1.P$2 C10.P$2 | C5.P$2 C9.P$2 53.34,3.16 54.5,2 62.21,2 | DONE.C 26,48.5 25.43,47.92 IC2.10 26.25,46.25 26.78,45.72 v27.94,45.72 | 82.5,68.09 IC7.5 | 82.5,68.09 83.33,68.09 v83.82,68.58 | 82.5,68.09 82.5,67 | 82.5,67 82.5,66 | C28.2 38,71.02 v38.1,71.12 | USB.4 59.2,65.2 59,65 58.4,65 | 58.4,65 54,65 53.34,65.66 53.34,67.25 | IC4.4 4.09,22.09 3.5,21.5 3.5,13.2 | U1.2 24.63,29.13 25.4,29.9 v25.4,35.56 | 3.5,13.2 2.8,13.2 2.5,13.5 R12.2 | 58.4,65 USB.5 | 53.34,67.25 v53.34,71.12 53.34,72.34 53.55,72.55 USB.PAD@4 | C26.2 87.5,11.5 87.71,11.21 SW4.3 SW4.4 87.71,2.71 87,2 79.21,2 | 62.21,2 SW1.4 SW1.3 63.92,9.93 64.5,10.5 C23.2 | 62.21,2 70.71,2 | 70.71,2 SW2.4 SW2.3 71.92,9.93 73.5,11.5 C24.2
  Top 0.203: 70.71,2 79.21,2 | 79.21,2 SW3.4 SW3.3 79.21,11.21 79.5,11.5 80,11.5 80.5,12 C25.2 | 5.79,11 4,11 3.5,11.5 3.5,13.2 | RESET.4 RESET.3 5.79,11 | 5.79,11 12,11 12.7,11.7 v12.7,12.7 13,13 C21.2 | USB.PAD@2 65.95,72.55 66.5,72 66.5,67.25 | 66.5,67.25 USB.PAD@1 | 53.34,67.25 USB.PAD@3 | IC3.7 5.69,51.69 5.08,51.08 v5.08,48.26 5.34,48 R6.2 | v7.62,60.96 7.62,63.12 8,63.5 C19.2 | 82.5,67 77.5,67 72,61.5 C22.2 | 66.5,67.25 67.71,66.04 v71.12,66.04
  Top 0.4: v76.2,30.48 66.5,30.48 64.5,30.48 62.5,30.48 60.5,30.48 57.02,30.48 54.5,33 | 8.81,32.42 POWER.9 1.5,32.42 1.5,42.58 POWER.1 8.81,42.58 | C27.2 69.58,64.5 v71.12,66.04
  Top 0.6: VPE.9 95.77,32.27 96.52,33.02 v96.52,35.56 | VPD.9 95.77,57.67 96.52,58.42 v96.52,60.96
  Bottom 0.2: POWER.2 8.81,42.58
  Bottom 0.203: POWER.9 2,32.42 2,9 5,9 H1.B3,2 8.5,5 8.5,2 91,2 91,5 H2.B3,2 95,9 98,9 98,35.56 | 98,35.56 98,42 | 98,42 98,60.96 | 98,60.96 98,66 95,66 H3.B3,2 91,70 91,73 83.82,73 | 17.78,73 9,73 9,70 H4.B3,2 5,66 2,66 1.5,65.5 1.5,50 2,49.5 2,48.26 | 2,42.5 2,32.5 | 98,35.56 v96.52,35.56 | 98,60.96 v96.52,60.96 | POWER.1 2.08,42.58 2,42.5 | 17.78,73 v17.78,63.5 | 2,42.5 2,48.26 | v7.62,60.96 7.62,59.88 17,50.5 17,45 15,43 15,42.58 | 2,48.26 v5.08,48.26 | 83.82,73 v83.82,68.58 | 83.82,73 71.12,73 | 71.12,73 v71.12,66.04 | v38.1,71.12 38.1,73 | 38.1,73 17.78,73 | v53.34,71.12 53.34,73 | 53.34,73 38.1,73 | 53.34,73 71.12,73 | 83.82,20.32 83.82,25.5 76.2,25.5 v76.2,30.48 | v27.94,45.72 19.72,45.72 19,45 19,42 17.5,40.5 | v25.4,35.56 22.44,35.56 17.5,40.5 | 12.05,42.58 15,42.58 | 15,42.58 15.42,42.58 17.5,40.5 | C12.P$2 78.82,43.18 80,42 98,42
  Bottom 0.6: C12.P$2 C7.P$2 C3.P$2 C13.P$2 76.2,52.1 | v76.2,30.48 C2.P$2 C11.P$2 76.2,38.5 | 83.82,20.32 83.82,15.24 81.28,12.7 C5.P$2 C9.P$2 C10.P$2 C1.P$2 C15.P$2 C6.P$2 v12.7,12.7 12.7,30.48 10.76,32.42 POWER.10 POWER.9 | C17.P$2 C16.P$2 C4.P$2 C8.P$2 C14.P$2 | POWER.2 POWER.1 8.81,42.58 12.05,42.58 | VPE.9 95.77,32.27 96.52,33.02 v96.52,35.56 | VPD.9 95.77,57.67 96.52,58.42 v96.52,60.96
  pour Bottom (isolate 0.5, rank 2): 0,75 100,75 100,0 0,0
  pour Top: 43.5,44 43.5,31.5 44,31 56.5,31 56.5,44
  pour Top: 22.75,68.75 28.75,68.75 28.75,63 28.5,62.75 22.75,62.75
JTAG_CCLK  (via drill 0.8 pad 1.6)
  Top 0.203: IC2.3 20.88,43.73 v20.32,43.18 | v60.96,45.72 60.96,44.46 60,43.5 IC1.50
  Bottom 0.2: v60.96,45.72 58.74,43.5 39.5,43.5 38,45
  Bottom 0.203: 38,45 32,45 31,44 21.14,44 v20.32,43.18
JTAG_DIN  (via drill 0.8 pad 1.6)
  Top 0.203: v63.5,40.64 63.36,40.5 IC1.44 | v20.32,40.64 19.05,41.91 19.05,44.45 19.57,44.98 IC2.1
  Bottom 0.2: v63.5,40.64 61.14,43 39,43 37.5,44.5
  Bottom 0.203: 37.5,44.5 32.5,44.5 31.5,43.5 23,43.5 20.32,40.82 v20.32,40.64
JTAG_DONE  (via drill 0.8 pad 1.6)
  Top 0.203: IC1.51 56,47.5 56.5,48 58,48 58.42,47.58 v58.42,45.72 | 30.5,48.5 DONE.A | 30.5,48.5 R1.2 | v30.48,45.72 30.48,48.48 30.5,48.5
  Bottom 0.2: v58.42,45.72 56.7,44 40,44 38.5,45.5
  Bottom 0.203: v30.48,45.72 30.7,45.5 38.5,45.5
JTAG_HSWAP
  Top 0.203: IC1.99 39,32 36.5,29.5 36.5,27 38,25.5 R4.2
JTAG_INIT_B  (via drill 0.8 pad 1.6)
  Top 0.203: v30.48,40.64 28.12,43 25.5,43 24.12,44.38 IC2.8 | R3.2 59,23 58.42,23.58 v58.42,25.4 57.1,25.4 56,26.5 IC1.25
  Bottom 0.2: v30.48,40.64 32.86,40.64 48.1,25.4 v58.42,25.4
JTAG_PROG_B  (via drill 0.8 pad 1.6)
  Top 0.203: IC1.1 44,27.5 42.5,26 40.5,26 | 40.5,26 R2.2 | 40.5,26 40.5,27.8 v40.64,27.94 | IC2.7 23.48,44.02 25,42.5 26.08,42.5 v27.94,40.64
  Bottom 0.2: v40.64,27.94 39.2,26.5 | 36.5,32.08 v27.94,40.64
  Bottom 0.203: 39.2,26.5 37.5,26.5 36.5,27.5 36.5,32.08
LED_1
  Top 0.203: R35.2 55.5,50 54.5,49 IC1.54
LED_2
  Top 0.203: IC1.53 55,48.5 55.5,49 R36.2
N$1
  Top 0.203: IC3.1 10.19,59.31 11,58.5 11,58.04 | 11,54.23 11,55.5 | 11,55.5 IC3.4 | 11,54.23 IC3.10 | 11,58.04 IC3.13 | 11,55.5 11,58.04 | 11,48.5 10.5,48 R6.1 | 11,48.5 12.46,48.5 JP1.P$2 | 11,48.5 11,54.23
N$2
  Top 0.203: LED1.C 61.5,53 62.5,52 62.5,50.5 62,50 R35.1
N$3
  Top 0.203: IC3.5 4.27,54.23 3,55.5 3,62 6,65 11,65 11.5,65.5 R5.2
N$4  (via drill 0.8 pad 1.6)
  other vias: 88.9,48.26
N$5
  Top 0.203: R7.2 16.5,62.5 17.5,61.5 19.5,61.5 21.5,59.5 21.5,57.5 16.96,52.96 IC3.9
N$6
  Top 0.203: R8.2 14.5,63.5 18,60 18,57.5 17.27,56.77 IC3.12
N$7  (via drill 0.8 pad 1.6)
  other vias: 8.81,37.5
N$11
  Top 0.203: LED2.C 67.5,53 68,52.5 68,50.5 67.5,50 65.5,50 64.5,49 R36.1
N$12  (via drill 0.8 pad 1.6)
  other vias: 8.81,40.04
N$15  (via drill 0.8 pad 1.6)
  other vias: 8.81,42.58
N$16  (via drill 0.8 pad 1.6)
  other vias: 8.81,34.96
N$17  (via drill 0.8 pad 1.6)
  other vias: 8.81,32.42
N$18
  Top 0.203: IC6.37 23,59 23.25,58.75 23.5,59 IC6.38
N$36  (via drill 0.8 pad 1.6)
  other vias: 83.82,48.26
N$37  (via drill 0.8 pad 1.6)
  other vias: 88.9,53.34
N$38  (via drill 0.8 pad 1.6)
  other vias: 83.82,53.34
N$39  (via drill 0.8 pad 1.6)
  other vias: 88.9,50.8
N$40  (via drill 0.8 pad 1.6)
  other vias: 83.82,50.8
N$41  (via drill 0.8 pad 1.6)
  other vias: 88.9,45.72
N$42  (via drill 0.8 pad 1.6)
  other vias: 83.82,45.72
N$47  (via drill 0.8 pad 1.6)
  other vias: 86.36,33.02
N$49  (via drill 0.8 pad 1.6)
  other vias: 86.36,30.48
N$58
  Top 0.203: R11.1 24.9,37.9 23.04,36.04 U1.3
RESET
  Top 0.203: IC1.85 39,39 37.5,37.5 35.5,37.5 34,36 28.5,36 27,34.5 27,28 25,26 18,26 15.37,23.36 15,23.36 | IC4.6 15,23.36 | 15,23.36 R10.2
RESET_IN
  Top 0.203: 2.5,24.64 R9.2 | 2.5,24.64 IC4.2 | R12.1 2.5,24.64
RESET_SW
  Top 0.203: RESET.1 RESET.2 13,18.93 | IC4.5 12.4,22.09 13,21.5 13,19.5 13,18.93 | 13,18.93 C21.1
RX
  Top 0.203: IC6.40 24.5,58.5 28.5,54.5 32.5,54.5 33.5,55.5 33.5,59.5 34.5,60.5 47,60.5 48,59.5 48,52 46.5,50.5 IC1.70
SW_1_IN
  Top 0.203: IC1.22 54.5,24 60.5,18 65.5,18 66,18.5 66,20.5 68,22.5 74,22.5 74.46,22.04 IC5.2
SW_1_IN_T
  Top 0.203: IC5.1 73.14,20 73.14,21.36 72.5,22 69,22 67.5,20.5 67.5,18 66.5,17 64.5,17 | R22.2 62.5,16.5 63,17 64.5,17 | 64.5,17 C23.1
SW_1_IN_T2
  Top 0.203: SW1.2 SW1.1 57.79,11.29 58,11.5 60.5,11.5 | R22.1 62.5,12 62,11.5 60.5,11.5 | 60.5,11.5 R14.2
SW_2_IN
  Top 0.203: IC1.23 55,24.5 61,18.5 65,18.5 65.5,19 65.5,21 67.5,23 76,23 77,22 IC5.4
SW_2_IN_T
  Top 0.203: R23.2 71.5,16 72,16.5 73.5,16.5 | 73.5,16.5 C24.1 | 73.5,16.5 73.5,17 75.73,19.23 IC5.3
SW_2_IN_T2
  Top 0.203: SW2.2 SW2.1 66.29,11.29 66.5,11.5 69.5,11.5 | R23.1 71.5,12 71,11.5 69.5,11.5 | 69.5,11.5 R15.2
SW_3_IN
  Top 0.203: IC1.24 55.5,25 61.5,19 64.5,19 65,19.5 65,21.5 67,23.5 78,23.5 79.54,21.96 IC5.6
SW_3_IN_T
  Top 0.203: C25.1 80.5,16 80,16.5 78.5,16.5 | IC5.5 78.27,16.73 78.5,16.5 | R24.2 78.5,16.5
SW_3_IN_T2
  Top 0.203: SW3.2 SW3.1 74.79,11.29 75,11.5 76.5,11.5 | R24.1 78.5,12 78,11.5 76.5,11.5 | 76.5,11.5 R16.2
SW_4_IN
  Top 0.203: IC1.26 66.87,31.5 67.12,31.75 78.25,31.75 80.81,29.19 IC5.8
SW_4_IN_T
  Top 0.203: IC5.9 79.54,24.96 86.5,18 86.5,16.5 | R25.2 85.5,16 86,16.5 86.5,16.5 | C26.1 87.5,16 87,16.5 86.5,16.5
SW_4_IN_T2
  Top 0.203: 83.5,11.5 83.29,11.29 SW4.1 SW4.2 | 83.5,11.5 85,11.5 85.5,12 R25.1 | 83.5,11.5 R17.2
SW_PD_1
  Top 0.203: R20.1 62.5,25.5 63.5,24.5 75.5,24.5 77,26 IC5.11
SW_PD_2
  Top 0.203: R21.1 64.5,25.5 65,25 73.5,25 74.46,25.96 IC5.13
T_7SEG_1_1
  Top 0.203: 7SEG1.1 17.46,6.04 19.5,4 39.5,4 41,2.5 R33.2
T_7SEG_1_2
  Top 0.203: 7SEG1.2 18.73,5.77 20,4.5 40,4.5 41,3.5 R31.2
T_7SEG_1_4
  Top 0.203: 7SEG1.4 21.27,6.23 22.5,5 40.5,5 41,4.5 R29.2
T_7SEG_1_5
  Top 0.203: 7SEG1.5 22.54,6.46 23.5,5.5 R27.2
T_7SEG_1_6
  Top 0.203: R37.2 31.5,25 30.5,24 23.5,24 22.54,23.04 7SEG1.6
T_7SEG_1_7
  Top 0.203: R39.2 30.5,25.5 29.5,24.5 22.5,24.5 21.27,23.27 7SEG1.7
T_7SEG_1_9
  Top 0.203: R41.2 29.5,25.5 29,25 20.5,25 18.73,23.23 7SEG1.9
T_7SEG_1_10
  Top 0.203: R44.2 28.5,26.5 27.5,25.5 19,25.5 17.46,23.96 7SEG1.10
T_7SEG_2_1
  Top 0.203: 7SEG2.1 27.46,7.54 29,6 40.5,6 41,6.5 R34.2
T_7SEG_2_2
  Top 0.203: 7SEG2.2 28.73,7.27 29.5,6.5 40,6.5 41,7.5 R32.2
T_7SEG_2_4
  Top 0.203: R30.2 34,8 33.5,7.5 31.5,7.5 31.27,7.73 7SEG2.4
T_7SEG_2_5
  Top 0.203: 7SEG2.5 33.75,8.75 34,9 R28.2
T_7SEG_2_6
  Top 0.203: 7SEG2.6 32.54,13.46 35,11 R38.2
T_7SEG_2_7
  Top 0.203: 7SEG2.7 31.27,12.73 34,10 R40.2
T_7SEG_2_9
  Top 0.203: R42.2 33.5,24.5 32,23 29,23 28.73,22.73 7SEG2.9
T_7SEG_2_10
  Top 0.203: R45.2 32.5,24.5 31.5,23.5 28,23.5 27.46,22.96 7SEG2.10
TCK  (via drill 0.8 pad 1.6)
  Top 0.203: IC1.77 37.92,43 v35.56,40.64 | v25.4,40.64 22.82,43.22 IC2.6 22.82,48.67 21,50.5 18.5,50.5 17.31,51.69 IC3.8
  Bottom 0.203: v25.4,40.64 25.4,41.4 26.5,42.5 33.7,42.5 v35.56,40.64
TCK_FTDI
  Top 0.203: IC6.24 23,71 22.5,71.5 17,71.5 16.5,71 R7.1
TDI  (via drill 0.8 pad 1.6)
  Top 0.203: IC2.4 21.52,47.98 21,48.5 18.28,48.5 17.78,48 v17.78,43.18 | v20.32,58.42 17.4,55.5 IC3.11
  Bottom 0.203: v20.32,58.42 18.92,58.42 17.78,57.28 v17.78,43.18
TDI_FTDI
  Top 0.203: IC6.23 23.5,71.5 23,72 15.5,72 14.5,71 R8.1
TDIO  (via drill 0.8 pad 1.6)
  Top 0.203: IC2.17 21.52,50.98 22,50.5 25.5,50.5 27,52 34,52 36,50 36,48 33,45 33,38.12 v33.02,38.1 | v38.1,27.94 38.1,30.1 39.5,31.5 IC1.100
  Bottom 0.203: v33.02,38.1 33.02,36.48 38.1,31.4 v38.1,27.94
TDO  (via drill 0.8 pad 1.6)
  Top 0.203: IC1.76 39.5,43.5 39,44 39,45.5 39.22,45.72 v40.64,45.72 | IC3.2 5.96,58.04 5.08,58.92 v5.08,60.96
  Bottom 0.2: v40.64,45.72 38.56,47.8 30,47.8
  Bottom 0.203: 30,47.8 22.68,47.8 21.59,48.9 21.59,59.19 20.78,60 12,60 9.5,62.5 6,62.5 5.08,61.58 v5.08,60.96
TDO_FTDI
  Top 0.203: 24,70 IC6.22 24,72 23.5,72.5 14.5,72.5 13,71 13,66 11.5,64.5 6.5,64.5 3.5,61.5 3.5,58.5 5.23,56.77 IC3.3
TMS  (via drill 0.8 pad 1.6)
  Top 0.203: IC1.75 44,47.5 43.5,48 42.5,48 41.49,46.99 39.37,46.99 v35.56,43.18 | v22.86,40.64 22.18,41.33 IC2.5 22.18,48.33 21,49.5 18,49.5 17,48.5 17,47.48 16.51,46.99 4.41,46.99 3.6,47.8 3.6,51.4 5.16,52.96 IC3.6
  Bottom 0.203: v22.86,40.64 25.22,43 35.38,43 v35.56,43.18
TMS_FTDI
  Top 0.203: IC6.21 24.5,72.5 24,73 13.5,73 11.5,71 R5.1
TX
  Top 0.203: IC6.39 24,58 28,54 33,54 34,55 34,59 35,60 46.5,60 47.5,59 47.5,52.5 46,51 IC1.71
USB_33OUT
  Top 0.203: IC6.6 37.5,65.5 38,66 C28.1
USB_AVCC
  Top 0.203: IC6.46 27.5,59.5 28.5,58.5 31,58.5 32,59.5 32,61 33,62 40.5,62 | 40.5,62 48.5,62 49.5,61 66.5,61 67,61.5 C22.1 | R13.2 41,63 40.5,62.5 40.5,62
USB_CON1
  Top 0.4: FB1.1 49.5,68 50,67.5 50,65 51.75,63.25 60.75,63.25 61.6,64.1 61.6,64.5 | USB.1 61.6,64.5 | C27.1 61.6,64.5
USB_CON2
  Top 0.203: R18.1 51,70 51.5,69.5 51.5,65 52.5,64 60,64 60.8,64.8 USB.2
USB_CON3
  Top 0.203: R19.1 51,72.5 52,71.5 52,65.5 53,64.5 59.5,64.5 60,65 USB.3
USB_DM  (via drill 0.8 pad 1.6)
  Top 0.203: v33.02,68.58 33.02,67.06 32.46,66.5 IC6.8 | v40.64,68.58 42.06,70 R18.2
  Bottom 0.4: v33.02,68.58 v40.64,68.58
USB_DP
  Top 0.203: 46,72.5 R19.2 | R26.1 45.5,71 46,71.5 46,72.5 | 46,72.5 37.5,72.5 36.83,71.89 36.83,66.81 36.02,66 IC6.7
USB_POW  (via drill 0.8 pad 1.6)
  Top 0.203: IC6.42 25.5,58.5 28.12,55.88 v30.48,55.88 | IC6.3 38,64 40.5,66.5 41.1,66.5 v43.18,68.58 | R13.1 45.22,63 v45.72,63.5
  Top 0.4: FB1.2 43.76,68 v43.18,68.58
  Bottom 0.4: v30.48,55.88 30.48,60.96 33.02,63.5 43.18,63.5 | 43.18,63.5 v45.72,63.5 | v43.18,68.58 43.18,63.5
USB_RSTOUT_
  Top 0.203: IC6.5 38,65 39,66 39,69.5 40.5,71 R26.2
VCCAUX  (via drill 0.8 pad 1.6)
  Top 0.203: IC1.74 44.5,49.48 C8.P$1 | C7.P$1 65.22,45.72 61,41.5 IC1.46 | IC1.96 38.5,33.5 35.5,30.5 35.5,20.38 C6.P$1 | R2.1 40.5,20.46 v40.64,20.32 39,20.32 38,21.32 R4.1 | IC1.21 54,22.2 C5.P$1 | v63.5,20.32 63.5,22.5 63,23 R3.1 | 4,37.5 8.81,37.5 | R1.1 34.5,48.5 35,49 35,50 34,51 28.14,51 v27.94,50.8 | IC2.20 19.57,54.58 20,55 | v22.86,55.88 20.88,55.88 20,55 | IC2.19 20.23,54.77 20,55
  Top 0.4: POWER.5 4,37.5 13,37.5 14,38.5
  Top 0.406: v10.16,45.72 12.06,45.72 14,43.78 14,38.5
  Bottom 0.4: 10.16,50 v10.16,45.72 10.16,48.26 | 10.16,50 10.16,50.24 3.5,56.91 3.5,61.5 5.5,63.5 10,63.5 12.5,61 21,61 22.86,59.14 v22.86,55.88 22.86,53.34 25.4,50.8 v27.94,50.8 | JP1.P$1 13.5,50 10.16,50
  Bottom 0.6: POWER.5 POWER.6 13.3,37.5 17.78,33.02 17.78,22.86 20.32,20.32 C6.P$1 v40.64,20.32 C5.P$1 v63.5,20.32 66.04,20.32 68.58,22.86 C7.P$1 68.58,50.8 C8.P$1 v27.94,50.8
VCCINT
  Top 0.203: IC1.28 65.5,32.5 66.02,33.02 C2.P$1 | IC1.80 38.5,41.5 36,39 35,39 34,40 34,44 38.26,48.26 C4.P$1 | IC1.56 53.5,53 55,54.5 67,54.5 69,52.5 69,50 68,49 66.78,49 C3.P$1 | IC1.6 46.5,23.64 C1.P$1
  Top 0.4: POWER.3 8.81,40.04
  Bottom 0.6: POWER.3 POWER.4 14.56,40.04 20.32,34.28 20.32,25.4 22.86,22.86 C1.P$1 63.5,22.86 66.04,25.4 C2.P$1 C3.P$1 C4.P$1
VCCO  (via drill 0.8 pad 1.6)
  Top 0.203: IC1.82 38.5,40.5 36.5,38.5 34.5,38.5 33.5,39.5 33.5,44.5 38.1,49.1 C16.P$1 | C17.P$1 27.66,53.34 25.5,55.5 | C14.P$1 45.72,51.72 45,51 IC1.73 | C10.P$1 48.22,17.78 47.5,18.5 IC1.8 | R15.1 69.5,16.16 v71.12,17.78 | IC1.31 65,34 66.56,35.56 C11.P$1 | C12.P$1 63.68,43.18 61.5,41 IC1.45 | IC1.97 39,33 36,30 36,22 38.1,19.9 C15.P$1 | C20.1 66.5,26 67,25.5 71.12,25.5 | IC5.14 73.19,25.69 73,25.5 71.12,25.5 | v71.12,27.94 71.12,25.5 | R46.2 67.5,72.5 68,73 82,73 82.5,72.5 82.5,71.91 | v58.42,17.78 59.2,17 60,17 60.5,16.5 R14.1 | IC6.31 20,65.5 19.5,65 19.5,62.5 22,60 22,59 25.5,55.5 | POWER.8 8.81,34.96 | v88.9,68.58 88.9,71.1 88.09,71.91 82.5,71.91 | 82.5,71.91 IC7.8 | IC6.14 28,71.5 28.5,72 29.12,72 30,71.12 v35.56,71.12 34.18,72.5 C18.1 | IC1.55 54,51.46 v55.88,53.34 | LED1.A 56.22,53 v55.88,53.34 | LED2.A 62.5,53 61.5,54 56.54,54 v55.88,53.34 | R9.1 2.5,29 3,29.5 13.5,29.5 | 15,29.5 13.5,29.5 | 15,29.5 R10.1 | IC4.7 13.13,24.64 13.5,25 13.5,29.5 | 15,33.33 15,29.5 | 15,33.33 U1.4 | 15,34.96 15,33.33 | IC1.20 53.5,17.94 C9.P$1 | 20,17.78 7SEG1.8 | 20,17.78 v15.24,17.78 | 7SEG1.3 20,16.49 | 30,16.49 7SEG2.3 | 30,16.49 7SEG2.8 | R16.1 76.5,17.48 v76.2,17.78 | v81.28,17.78 82.72,17.78 83.5,17 R17.1 | 20,16.49 30,16.49 | 20,16.49 20,17.78 | IC2.18 20.88,54.38 21,54.5 24.5,54.5 25.5,55.5 | IC3.14 15.95,60.25 v12.7,63.5 C19.1
  Top 0.4: POWER.7 8.81,34.96 15,34.96 15.24,34.96 v15.24,45.72
  Top 0.6: VPE.10 93.23,32.27 93.98,33.02 v93.98,38.1 | VPD.10 93.23,57.67 93.98,58.42 v93.98,63.5
  Bottom 0.203: v15.24,17.78 15.48,17.78 15.88,17.38
  Bottom 0.4: 2.5,54.5 2.5,54.42 | 2.5,54.5 2.5,62 5,64.5 11.7,64.5 v12.7,63.5 14.2,62 21.5,62 | 21.5,62 21.54,62 30.66,71.12 v35.56,71.12 | v15.24,45.72 13.49,45.72 | 8,45.5 8,49 2.5,54.5 | C17.P$1 30.16,53.34 21.5,62
  Bottom 0.406: 13.49,45.72 13.34,45.72 11.43,43.81 9.69,43.81 8,45.5
  Bottom 0.6: v71.12,17.78 v58.42,17.78 C9.P$1 49.8,17.8 48.28,17.8 C10.P$1 C15.P$1 v15.24,17.78 15.24,30.48 10.76,34.96 POWER.8 POWER.7 | v71.12,17.78 v71.12,27.94 C11.P$1 71.12,40.64 | v81.28,17.78 v76.2,17.78 v71.12,17.78 | 71.12,40.64 C12.P$1 C13.P$1 71.12,53.34 | 71.12,53.34 v55.88,53.34 C14.P$1 C16.P$1 C17.P$1 | VPE.10 93.23,32.27 93.98,33.02 v93.98,38.1 91.44,40.64 71.12,40.64 | VPD.10 93.23,57.67 93.98,58.42 v93.98,63.5 88.9,63.5 | 71.12,53.34 81.28,63.5 88.9,63.5 | v88.9,68.58 88.9,63.5
VPORT_1_1
  Top 0.203: VPD.1 94.5,42.65 91.97,42.65 90.17,44.45 87.63,44.45 86.36,45.72 79.78,45.72 78.5,47 78.5,52.5 77.5,53.5 71,53.5 68.5,56 53.5,56 52,54.5 52,48 51.5,47.5 IC1.60
  Bottom 0.203: VPD.1 94.5,42.65 91.97,42.65 90.17,44.45 87.63,44.45 86.36,45.72 83.82,45.72
VPORT_1_2
  Top 0.203: IC1.61 51,48 51.5,48.5 51.5,55 53,56.5 69,56.5 71.5,54 78,54 79,53 79,47.5 79.51,46.99 86.36,46.99 87.63,45.72 90.17,45.72 91.97,43.92 VPD.2
  Bottom 0.203: VPD.2 91.97,43.92 90.17,45.72 88.9,45.72
VPORT_1_3
  Top 0.203: VPD.3 94.5,45.19 91.97,45.19 90.17,46.99 87.63,46.99 86.36,48.26 79.74,48.26 79.5,48.5 79.5,53.5 78.5,54.5 72,54.5 69.5,57 52.5,57 51,55.5 51,49 50.5,48.5 IC1.62
  Bottom 0.203: VPD.3 94.5,45.19 91.97,45.19 90.17,46.99 87.63,46.99 86.36,48.26 83.82,48.26
VPORT_1_4
  Top 0.203: IC1.63 50,49 50.5,49.5 50.5,56 52,57.5 70,57.5 72.5,55 79,55 80,54 80,50.5 81.05,49.53 86.36,49.53 87.63,48.26 90.17,48.26 91.97,46.46 VPD.4
  Bottom 0.203: VPD.4 91.97,46.46 90.17,48.26 88.9,48.26
VPORT_1_5
  Top 0.203: VPD.5 94.5,47.73 91.97,47.73 90.17,49.53 87.63,49.53 86.36,50.8 81.2,50.8 80.5,51.5 80.5,54.5 79.5,55.5 73,55.5 70.5,58 51.5,58 50,56.5 50,50 49,49 IC1.65
  Bottom 0.203: VPD.5 94.5,47.73 91.97,47.73 90.17,49.53 87.63,49.53 86.36,50.8 83.82,50.8
VPORT_1_6
  Top 0.203: IC1.66 48.5,49.5 49.5,50.5 49.5,57 51,58.5 71,58.5 73.5,56 80,56 81,55 81,53 81.93,52.07 86.36,52.07 87.63,50.8 90.17,50.8 91.97,49 VPD.6
  Bottom 0.203: VPD.6 91.97,49 90.17,50.8 88.9,50.8
VPORT_1_7
  Top 0.203: VPD.7 94.5,50.27 91.97,50.27 90.17,52.07 87.63,52.07 86.36,53.34 83.66,53.34 80.5,56.5 74,56.5 71.5,59 50.5,59 49,57.5 49,51 48,50 IC1.67
  Bottom 0.203: VPD.7 94.5,50.27 91.97,50.27 90.17,52.07 87.63,52.07 86.36,53.34 83.82,53.34
VPORT_1_8
  Top 0.203: IC1.68 47.5,50.5 48.5,51.5 48.5,58 50,59.5 72,59.5 74.5,57 85.24,57 88.9,53.34 90.16,53.34 91.96,51.54 VPD.8
  Bottom 0.203: VPD.8 91.96,51.54 90.16,53.34 88.9,53.34
VPORT_2_1  (via drill 0.8 pad 1.6)
  Top 0.203: IC1.33 65,35 67.5,37.5 76.5,37.5 77.5,36.5 77.5,33.52 80.54,30.48 v81.28,30.48 83.82,30.48 87,27.3 87,20.5 88.85,18.65 94.5,18.65 VPE.1
  Bottom 0.203: v81.28,30.48 83.82,30.48 87,27.3 87,20.5 88.85,18.65 94.5,18.65 VPE.1
VPORT_2_2
  Top 0.203: IC1.34 64.5,35.5 67,38 76.8,38 77.96,36.84 77.96,34.04 80.25,31.75 83.82,31.75 85.09,30.48 86.36,30.48 87.5,29.34 87.5,21.5 89.08,19.92 VPE.2
  Bottom 0.203: VPE.2 89.08,19.92 87.5,21.5 87.5,29.34 86.36,30.48
VPORT_2_3  (via drill 0.8 pad 1.6)
  Top 0.203: IC1.35 64,36 66.5,38.5 77.07,38.5 78.46,37.11 78.46,34.53 79.97,33.02 v81.28,33.02 83.82,33.02 85.09,31.75 87.13,31.75 88,30.88 88,22.5 89.31,21.19 94.5,21.19 VPE.3
  Bottom 0.203: v81.28,33.02 83.82,33.02 85.09,31.75 87.13,31.75 88,30.88 88,22.5 89.31,21.19 94.5,21.19 VPE.3
VPORT_2_4
  Top 0.203: IC1.36 63.5,36.5 66,39 77.5,39 78.96,37.54 78.96,35.57 80.24,34.29 83.82,34.29 85.09,33.02 87.9,33.02 88.5,32.42 88.5,24 90.04,22.46 VPE.4
  Bottom 0.203: VPE.4 90.04,22.46 88.5,24 88.5,32.42 87.9,33.02 86.36,33.02
VPORT_2_5  (via drill 0.8 pad 1.6)
  Top 0.203: IC1.40 64.5,38.5 65.5,39.5 78,39.5 79.46,38.04 79.46,36.04 79.94,35.56 v81.28,35.56 83.82,35.56 85.09,34.29 87.9,34.29 89,33.19 89,25 90.27,23.73 94.5,23.73 VPE.5
  Bottom 0.203: v81.28,35.56 83.82,35.56 85.09,34.29 87.9,34.29 89,33.19 89,25 90.27,23.73 94.5,23.73 VPE.5
VPORT_2_6  (via drill 0.8 pad 1.6)
  Top 0.203: IC1.41 64,39 65,40 78.5,40 79.96,38.54 79.96,37.04 80.17,36.83 83.82,36.83 85.09,35.56 v86.36,35.56 87.9,35.56 89.5,33.96 89.5,26 90.5,25 VPE.6
  Bottom 0.203: v86.36,35.56 87.9,35.56 89.5,33.96 89.5,26 90.5,25 VPE.6
VPORT_2_7  (via drill 0.8 pad 1.6)
  Top 0.203: IC1.57 53,53.5 54.5,55 67.5,55 70,52.5 76.5,52.5 77.5,51.5 77.5,44.5 79,43 84,43 85.5,41.5 85.5,40 83.6,38.1 | VPE.7 94.5,26.27 90.73,26.27 90,27 90,35.5 88.67,36.83 85.09,36.83 83.82,38.1 83.6,38.1 | 83.6,38.1 v81.28,38.1
  Bottom 0.203: v81.28,38.1 83.82,38.1 85.09,36.83 88.67,36.83 90,35.5 90,27 90.73,26.27 94.5,26.27 VPE.7
VPORT_2_8  (via drill 0.8 pad 1.6)
  Top 0.203: IC1.58 52.5,54 54,55.5 68,55.5 70.5,53 77,53 78,52 78,45 79.5,43.5 84.5,43.5 86.36,41.64 v86.36,38.1 89.17,38.1 90.5,36.77 90.5,28.5 91.46,27.54 VPE.8
  Bottom 0.203: v86.36,38.1 89.17,38.1 90.5,36.77 90.5,28.5 91.46,27.54 VPE.8
XTIN
  Top 0.203: IC6.43 26,59 27.5,57.5 32,57.5 33,58.5 33,60 34,61 47.5,61 48.5,60 72.5,60 75,57.5 88,57.5 91,60.5 91,61.5 | C29.1 88.5,66 91,63.5 91,61.5 | 91,61.5 U2.P$1
XTOUT
  Top 0.203: IC6.44 26.5,59.5 28,58 31.5,58 32.5,59 32.5,60.5 33.5,61.5 48,61.5 49,60.5 73,60.5 74,61.5 | 74,61.5 U2.P$2 | C30.1 77.5,66 74,62.5 74,61.5

### Text on the board
Bottom: AZPR EvBoard v.1.0 | http://respon.org/
tPlace: EEPROM | USB | FT2232 | AZPR EvBoard | VREF | v.1.0 | CRYSTAL | CONFIG | TMS | TDO | GND | GND | TCK | VPD(IO8) | 1.2V | VCCO=3.3V | TDI | 2.5V | 3.3V | GND | CLOCK | XC3S250E | VPE(IO8) | VCCO=3.3V | 7SEG1 | 7SEG2 | http://respon.org/
Hidden: FPGA
tPlace_et: FT2232 | EEPROM | USB | + | + | LED_1 | LED_2 | JP1 | DONE | + | CONF | GND | 1.2V | AZPR EvBoard v.1.0 | VPD | 2.5V | 3.3V | GND | CLOCK | VPE | RESET | 7SEG_1 | 7SEG_2 | SW_1 | SW_2 | SW_3 | SW_4 | http://respon.org/